# EAGLE schematic cft (EAGLE 5.11), part 5 of 7
## Sheet 34 of 49
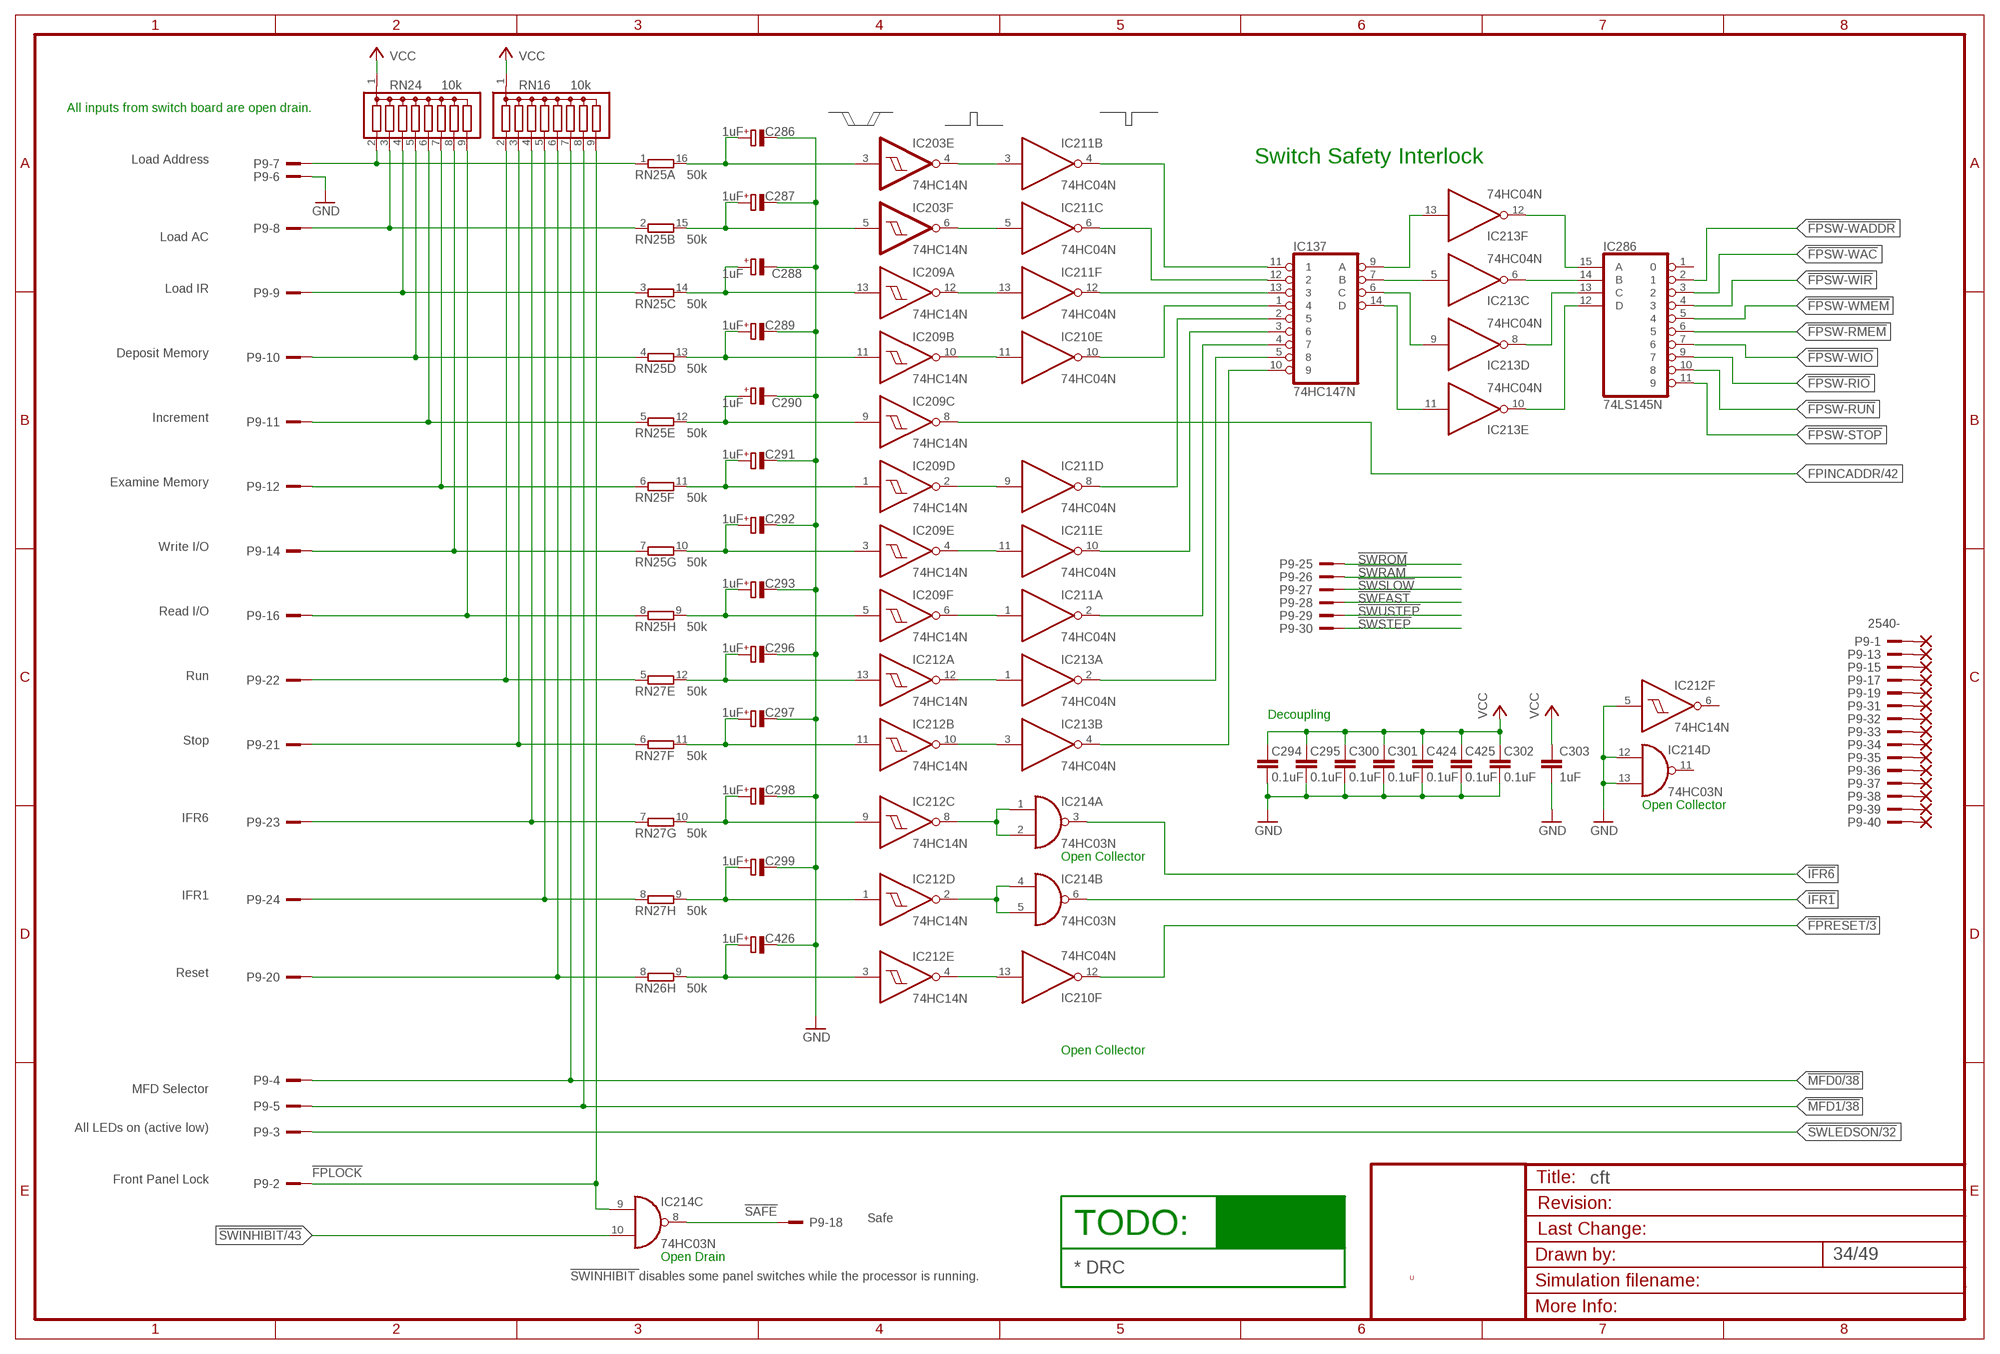
[diagram p33: schematic, sheet 34]

### Parts
C286  1uF  CPOL-EUE1.8-4  [E1,8-4]
C287  1uF  CPOL-EUE1.8-4  [E1,8-4]
C288  1uF  CPOL-EUE1.8-4  [E1,8-4]
C289  1uF  CPOL-EUE1.8-4  [E1,8-4]
C290  1uF  CPOL-EUE1.8-4  [E1,8-4]
C291  1uF  CPOL-EUE1.8-4  [E1,8-4]
C292  1uF  CPOL-EUE1.8-4  [E1,8-4]
C293  1uF  CPOL-EUE1.8-4  [E1,8-4]
C294  0.1uF  C-EU025-024X044  [C025-024X044]
C295  0.1uF  C-EU025-024X044  [C025-024X044]
C296  1uF  CPOL-EUE1.8-4  [E1,8-4]
C297  1uF  CPOL-EUE1.8-4  [E1,8-4]
C298  1uF  CPOL-EUE1.8-4  [E1,8-4]
C299  1uF  CPOL-EUE1.8-4  [E1,8-4]
C300  0.1uF  C-EU025-024X044  [C025-024X044]
C301  0.1uF  C-EU025-024X044  [C025-024X044]
C302  0.1uF  C-EU025-024X044  [C025-024X044]
C303  1uF  C-EU025-024X044  [C025-024X044]
C424  0.1uF  C-EU025-024X044  [C025-024X044]
C425  0.1uF  C-EU025-024X044  [C025-024X044]
C426  1uF  CPOL-EUE1.8-4  [E1,8-4]
IC137  74HC147N  [DIL16]
IC203  74HC14N  [DIL14]
IC209  74HC14N  [DIL14]
IC210  74HC04N  [DIL14]
IC211  74HC04N  [DIL14]
IC212  74HC14N  [DIL14]
IC213  74HC04N  [DIL14]
IC214  74HC03N  [DIL14]
IC286  74LS145N  [DIL16]
P9  2540-  [PAK100/2500-40]
PAD58  1,6/0,8  [1,6/0,8]
PAD61  1,6/0,8  [1,6/0,8]
PAD62  1,6/0,8  [1,6/0,8]
PAD63  1,6/0,8  [1,6/0,8]
PAD64  1,6/0,8  [1,6/0,8]
PAD71  1,6/0,8  [1,6/0,8]
PAD72  1,6/0,8  [1,6/0,8]
PAD73  1,6/0,8  [1,6/0,8]
PAD74  1,6/0,8  [1,6/0,8]
PAD75  1,6/0,8  [1,6/0,8]
PAD76  1,6/0,8  [1,6/0,8]
PAD77  1,6/0,8  [1,6/0,8]
PAD78  1,6/0,8  [1,6/0,8]
PAD79  1,6/0,8  [1,6/0,8]
PAD80  1,6/0,8  [1,6/0,8]
RN16  10k  G08R  [SIL9]
RN24  10k  G08R  [SIL9]
RN25  50k  8R-N  [DIL16]
RN26  50k  8R-N  [DIL16]
RN27  50k  8R-N  [DIL16]

### Nets
!FPLOCK: IC214.9(C:I0) P9.2 RN16.9 ; also sheet 33,35
!FPRESET: IC210.12(F:O) ; also sheet 3,6,40
!FPRIO: IC137.4 IC211.2(A:O) ; also sheet 40,42
!FPRMEM: IC137.2 IC211.8(D:O) ; also sheet 40,42
!FPRUN: IC137.5 IC213.2(A:O) ; also sheet 40,42,43
!FPSTOP: IC137.10 IC213.4(B:O) ; also sheet 40,43
!FPSW-RIO: IC286.9
!FPSW-RMEM: IC286.6
!FPSW-RUN: IC286.10
!FPSW-STOP: IC286.11
!FPSW-WAC: IC286.3
!FPSW-WADDR: IC286.2
!FPSW-WIO: IC286.7
!FPSW-WIR: IC286.4
!FPSW-WMEM: IC286.5
!FPWAC: IC137.12 IC211.6(C:O) ; also sheet 40,41,42
!FPWADDR: IC137.11 IC211.4(B:O) ; also sheet 40,41,42
!FPWIO: IC137.3 IC211.10(E:O) ; also sheet 40,41,42
!FPWIR: IC137.13 IC211.12(F:O) ; also sheet 40,41,42
!FPWMEM: IC137.1 IC210.10(E:O) ; also sheet 40,41,42
!IFR1: IC214.6(B:O) ; also sheet 39,40
!IFR6: IC214.3(A:O) ; also sheet 39,40
!MFD0: P9.4 RN16.7 ; also sheet 38
!MFD1: P9.5 RN16.8 ; also sheet 38
!SAFE: IC214.8(C:O) P9.18 ; also sheet 33,35
!SWFAST: P9.28 ; also sheet 33
!SWINHIBIT: IC214.10(C:I1) ; also sheet 40,43
!SWLEDSON: P9.3 ; also sheet 32,33
!SWRAM: P9.26 ; also sheet 33
!SWROM: P9.25 ; also sheet 33
!SWSLOW: P9.27 ; also sheet 33
!SWSTEP: P9.30 ; also sheet 33
!SWUSTEP: P9.29 ; also sheet 33
FPINCADDR: IC209.8(C:O) ; also sheet 40,42
GND [low power]: C286.- C287.- C288.- C289.- C290.- C291.- C292.- C293.- C294.1 C295.1 C296.- C297.- C298.- C299.- C300.1 C301.1 C302.1 C303.2 C424.1 C425.1 C426.- IC212.5(F:I) IC214.12(D:I0) IC214.13(D:I1) P9.6 ; also sheet 2,3,4,5,6,7,8,9,10,11,12,13,14,15,16,17,18,19,20,21,22,24,25,26,27,28,29,30,31,32,33,35,36,37,38,39,40,41,42,43,44,45,46,47,48,49
N$16: IC137.7(B) IC213.5(C:I)
N$116: IC137.6(C) IC213.9(D:I)
N$117: IC137.9(A) IC213.13(F:I)
N$118: IC137.14(D) IC213.11(E:I)
N$119: IC213.6(C:O) IC286.14(B)
N$291: C287.+ IC203.5(F:I) RN25.15
N$292: C288.+ IC209.13(A:I) RN25.14
N$294: C286.+ IC203.3(E:I) RN25.16
N$295: IC203.4(E:O) IC211.3(B:I)
N$296: IC203.6(F:O) IC211.5(C:I)
N$297: IC209.12(A:O) IC211.13(F:I)
N$298: IC209.10(B:O) IC210.11(E:I)
N$300: C291.+ IC209.1(D:I) RN25.11
N$301: IC209.2(D:O) IC211.9(D:I)
N$302: C292.+ IC209.3(E:I) RN25.10
N$303: IC209.4(E:O) IC211.11(E:I)
N$304: C293.+ IC209.5(F:I) RN25.9
N$305: IC209.6(F:O) IC211.1(A:I)
N$306: C289.+ IC209.11(B:I) RN25.13
N$307: P9.7 RN24.2 RN25.1
N$308: P9.8 RN24.3 RN25.2
N$309: P9.9 RN24.4 RN25.3
N$310: P9.10 RN24.5 RN25.4
N$311: P9.11 RN24.6 RN25.5
N$312: P9.12 RN24.7 RN25.6
N$313: P9.14 RN24.8 RN25.7
N$314: P9.16 RN24.9 RN25.8
N$315: C296.+ IC212.13(A:I) RN27.12
N$316: C297.+ IC212.11(B:I) RN27.11
N$317: P9.22 RN16.2 RN27.5
N$318: P9.21 RN16.3 RN27.6
N$319: IC212.12(A:O) IC213.1(A:I)
N$320: IC212.10(B:O) IC213.3(B:I)
N$321: C298.+ IC212.9(C:I) RN27.10
N$322: C299.+ IC212.1(D:I) RN27.9
N$332: P9.23 RN16.4 RN27.7
N$333: P9.24 RN16.5 RN27.8
N$334: IC212.8(C:O) IC214.1(A:I0) IC214.2(A:I1)
N$335: IC212.2(D:O) IC214.4(B:I0) IC214.5(B:I1)
N$336: C290.+ IC209.9(C:I) RN25.12
N$575: IC213.12(F:O) IC286.15(A)
N$576: IC213.8(D:O) IC286.13(C)
N$904: IC213.10(E:O) IC286.12(D)
N$916: P9.40 PAD80.1(P)
N$917: P9.1 PAD58.1(P)
N$921: P9.13 PAD61.1(P)
N$922: P9.15 PAD62.1(P)
N$923: P9.17 PAD63.1(P)
N$924: P9.19 PAD64.1(P)
N$931: P9.31 PAD71.1(P)
N$932: P9.32 PAD72.1(P)
N$933: P9.33 PAD73.1(P)
N$934: P9.34 PAD74.1(P)
N$935: P9.35 PAD75.1(P)
N$936: P9.36 PAD76.1(P)
N$937: P9.37 PAD77.1(P)
N$938: P9.38 PAD78.1(P)
N$939: P9.39 PAD79.1(P)
N$940: C426.+ IC212.3(E:I) RN26.9
N$941: P9.20 RN16.6 RN26.8
N$942: IC210.13(F:I) IC212.4(E:O)
VCC [low power]: C294.2 C295.2 C300.2 C301.2 C302.2 C303.1 C424.2 C425.2 RN16.1 RN24.1 ; also sheet 2,3,4,6,7,8,9,10,11,12,13,14,15,16,17,18,19,20,21,22,24,25,26,27,28,29,30,31,35,36,37,38,39,40,41,42,43,44,45,46,47,48,49
Unconnected: IC210.1(A:I) IC210.2(A:O) IC210.3(B:I) IC210.4(B:O) IC210.5(C:I) IC210.6(C:O) IC210.8(D:O) IC210.9(D:I) IC212.6(F:O) IC214.11(D:O) IC286.1 RN26.1 RN26.2 RN26.3 RN26.4 RN26.5 RN26.6 RN26.7 RN26.10 RN26.11 RN26.12 RN26.13 RN26.14 RN26.15 RN26.16 RN27.1 RN27.2 RN27.3 RN27.4 RN27.13 RN27.14 RN27.15 RN27.16

### Notes on the sheet
- All inputs from switch board are open drain.
- Load Address | Switch Safety Interlock
- Load AC
- Load IR
- Deposit Memory
- Increment
- Examine Memory
- Write I/O
- Read I/O
- Run
- Decoupling
- Stop
- Open Collector
- IFR6
- Open Collector
- IFR1
- Reset
- Open Collector
- MFD Selector
- All LEDs on (active low)
- Front Panel Lock
- Safe
- TODO:
- Open Drain
- * DRC
- !SWINHIBIT !disables some panel switches while the processor is running. | U

## Sheet 35 of 49
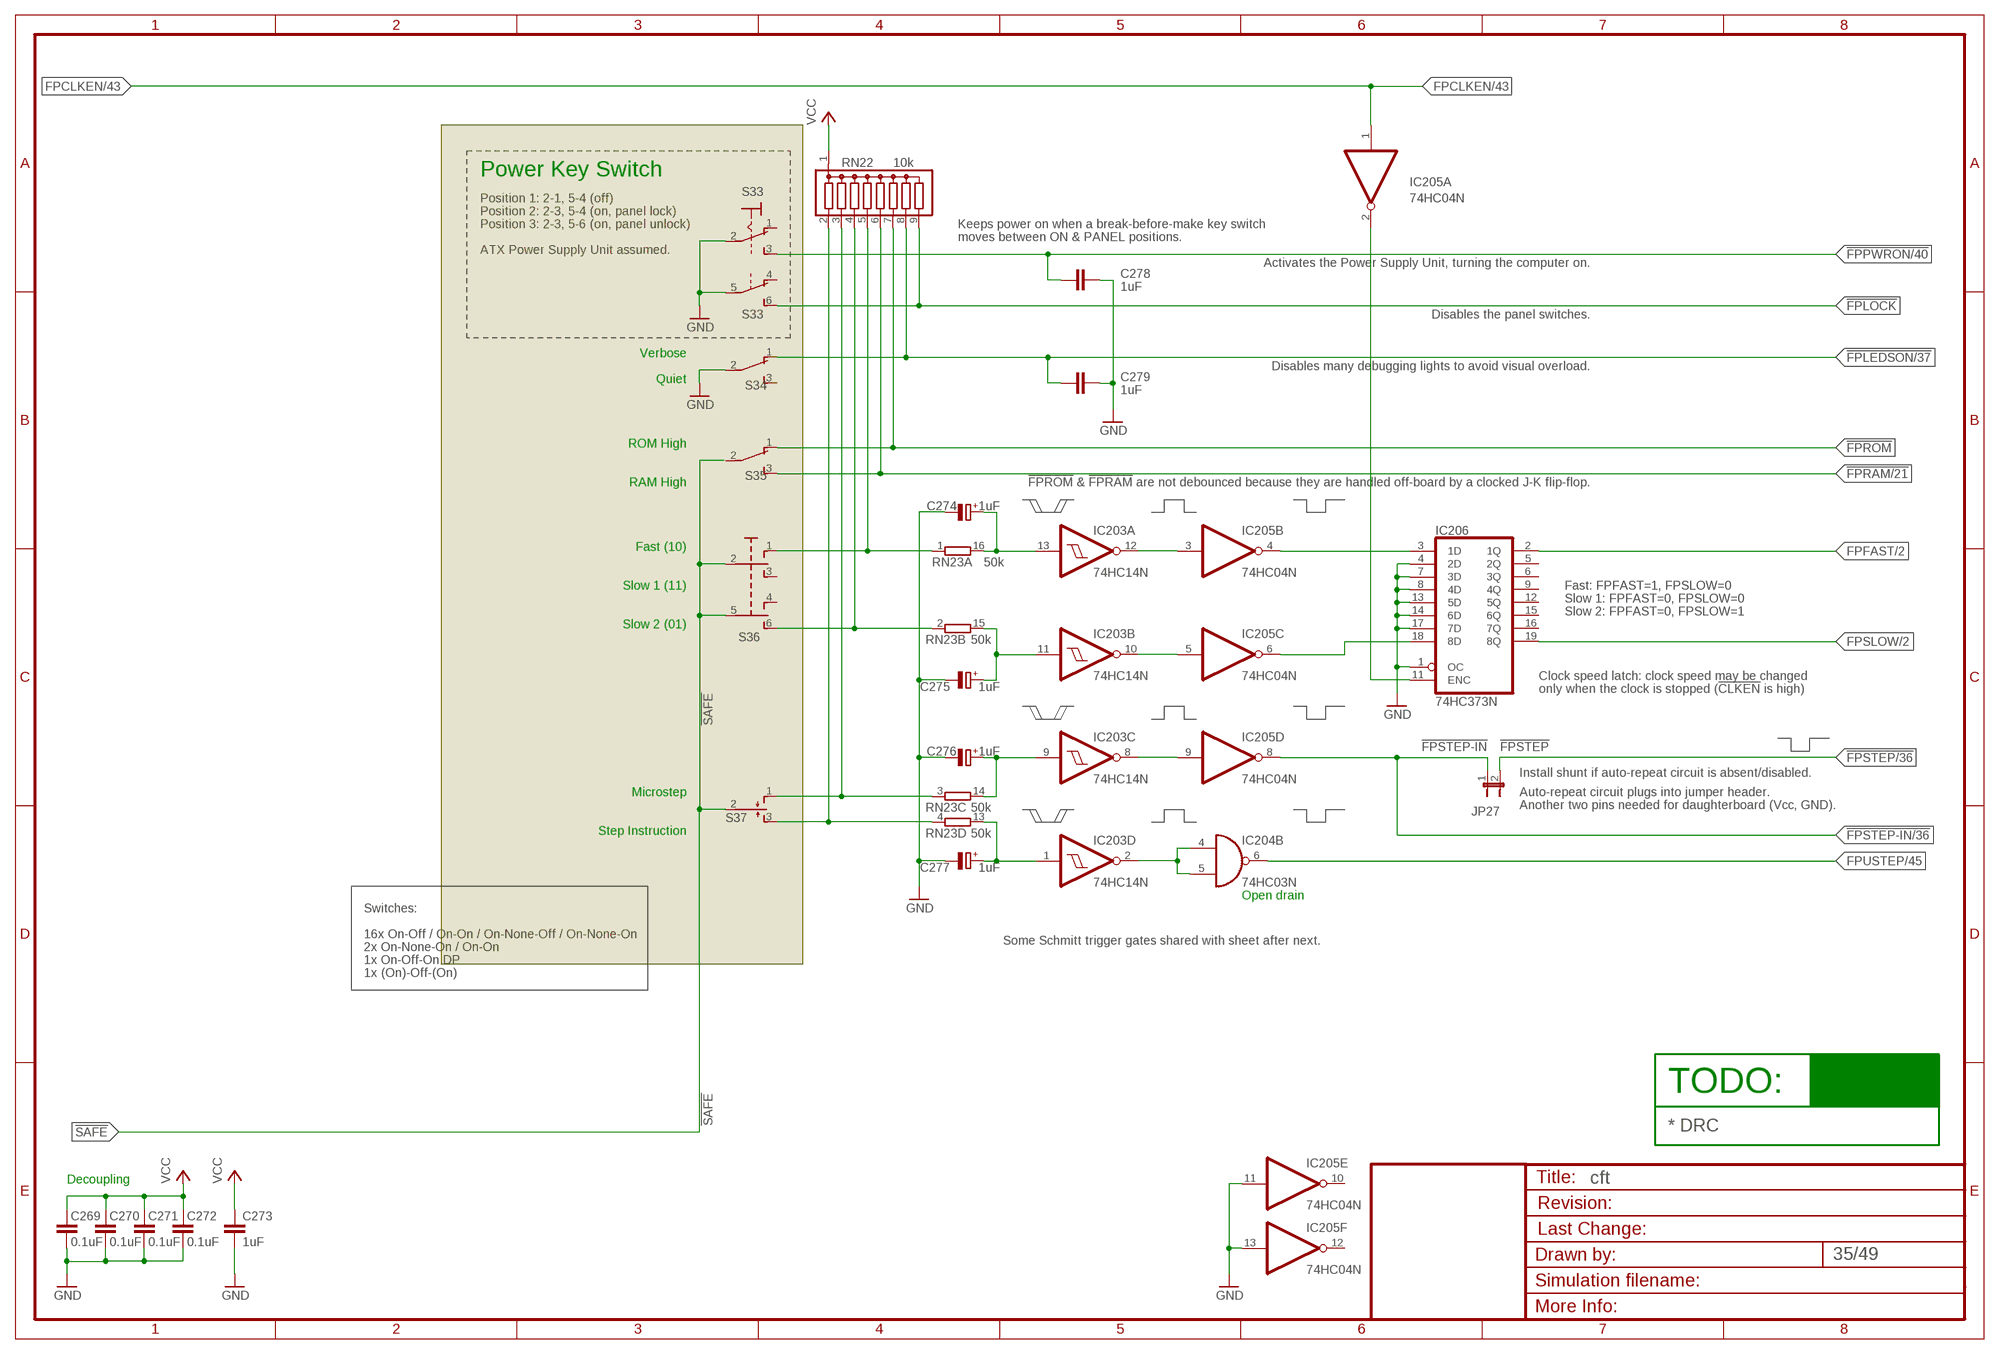
[diagram p34: schematic, sheet 35]

### Parts
C269  0.1uF  C-EU025-024X044  [C025-024X044]
C270  0.1uF  C-EU025-024X044  [C025-024X044]
C271  0.1uF  C-EU025-024X044  [C025-024X044]
C272  0.1uF  C-EU025-024X044  [C025-024X044]
C273  1uF  C-EU025-024X044  [C025-024X044]
C274  1uF  CPOL-EUE1.8-4  [E1,8-4]
C275  1uF  CPOL-EUE1.8-4  [E1,8-4]
C276  1uF  CPOL-EUE1.8-4  [E1,8-4]
C277  1uF  CPOL-EUE1.8-4  [E1,8-4]
C278  1uF  C-EU025-024X044  [C025-024X044]
C279  1uF  C-EU025-024X044  [C025-024X044]
IC204  74HC03N  [DIL14]
IC205  74HC04N  [DIL14]
IC206  74HC373N  [DIL20]
JP27  JP1E  [JP1]
RN22  10k  G08R  [SIL9]
RN23  50k  8R-N  [DIL16]
S33  320-938  [320-938]
S34  TL36PO  [TL3XPO]
S35  TL36PO  [TL3XPO]
S36  TL49PO  [TL4XPO]
S37  TL37PO  [TL3XPO]

### Nets
!FPLEDSON: C279.1 RN22.8 S34.1(O) ; also sheet 37,39
!FPLOCK: RN22.9 S33.6(B:S) ; also sheet 33,34
!FPPWRON: C278.1 S33.3(1:S) ; also sheet 40
!FPRAM: RN22.6 S35.3(S) ; also sheet 21,40
!FPROM: RN22.7 S35.1(O) ; also sheet 40
!FPSTEP: JP27.2 ; also sheet 36,40,43
!FPSTEP-IN: IC205.8(D:O) JP27.1 ; also sheet 36
!SAFE: S36.2(P) S36.5(P1) S37.2(P) ; also sheet 33,34
FPCLKEN: IC205.1(A:I) ; also sheet 2,6,43,45
FPFAST: IC206.2(1Q) ; also sheet 2,6,40
FPSLOW: IC206.19(8Q) ; also sheet 2,6,40
FPUSTEP: IC204.6(B:O) ; also sheet 2,6,40,45
GND [low power]: C269.1 C270.1 C271.1 C272.1 C273.2 C274.- C275.- C276.- C277.- C278.2 C279.2 IC205.11(E:I) IC205.13(F:I) IC206.1(OC) IC206.4(2D) IC206.7(3D) IC206.8(4D) IC206.13(5D) IC206.14(6D) IC206.17(7D) S33.2(1:P) S33.5(B:P) ; also sheet 2,3,4,5,6,7,8,9,10,11,12,13,14,15,16,17,18,19,20,21,22,24,25,26,27,28,29,30,31,32,33,34,36,37,38,39,40,41,42,43,44,45,46,47,48,49
N$277: C276.+ IC203.9(C:I) RN23.14
N$278: C277.+ IC203.1(D:I) RN23.13
N$279: RN22.3 RN23.3 S37.1(O)
N$281: RN22.2 RN23.4 S37.3(S)
N$282: C274.+ IC203.13(A:I) RN23.16
N$283: C275.+ IC203.11(B:I) RN23.15
N$284: IC203.2(D:O) IC204.4(B:I0) IC204.5(B:I1)
N$285: RN22.5 RN23.1 S36.1(O)
N$286: RN22.4 RN23.2 S36.6(S1)
N$287: IC203.12(A:O) IC205.3(B:I)
N$288: IC203.10(B:O) IC205.5(C:I)
N$290: IC203.8(C:O) IC205.9(D:I)
N$685 [low power]: S34.2(P)
N$688: IC205.4(B:O) IC206.3(1D)
N$689: IC205.6(C:O) IC206.18(8D)
N$691: IC205.2(A:O) IC206.11(ENC)
VCC [low power]: C269.2 C270.2 C271.2 C272.2 C273.1 RN22.1 ; also sheet 2,3,4,6,7,8,9,10,11,12,13,14,15,16,17,18,19,20,21,22,24,25,26,27,28,29,30,31,34,36,37,38,39,40,41,42,43,44,45,46,47,48,49
Unconnected: IC205.10(E:O) IC205.12(F:O) IC206.5(2Q) IC206.6(3Q) IC206.9(4Q) IC206.12(5Q) IC206.15(6Q) IC206.16(7Q) RN23.5 RN23.6 RN23.7 RN23.8 RN23.9 RN23.10 RN23.11 RN23.12 S33.1(1:O) S33.4(B:O) S34.3(S) S35.2(P) S36.3(S) S36.4(O1)

### Notes on the sheet
- Power Key Switch
- Position 1: 2-1, 5-4 (off)
- Position 2: 2-3, 5-4 (on, panel lock)
- Position 3: 2-3, 5-6 (on, panel unlock) | Keeps power on when a break-before-make key switch
- moves between ON & PANEL positions.
- ATX Power Supply Unit assumed.
- Activates the Power Supply Unit, turning the computer on.
- Disables the panel switches.
- Verbose
- Disables many debugging lights to avoid visual overload.
- Quiet
- ROM High
- RAM High | !FPROM! & !FPRAM! are not debounced because they are handled off-board by a clocked J-K flip-flop.
- Fast (10)
- Slow 1 (11) | Fast: FPFAST=1, FPSLOW=0
- Slow 1: FPFAST=0, FPSLOW=0
- Slow 2: FPFAST=0, FPSLOW=1
- Slow 2 (01)
- Clock speed latch: clock speed may be changed
- only when the clock is stopped (!CLKEN! is high)
- Install shunt if auto-repeat circuit is absent/disabled.
- Microstep | Auto-repeat circuit plugs into jumper header.
- Another two pins needed for daughterboard (Vcc, GND).
- Step Instruction
- Open drain
- Switches:
- 16x On-Off / On-On / On-None-Off / On-None-On
- Some Schmitt trigger gates shared with sheet after next.
- 2x On-None-On / On-On
- 1x On-Off-On DP
- 1x (On)-Off-(On)
- TODO:
- * DRC
- Decoupling

## Sheet 36 of 49
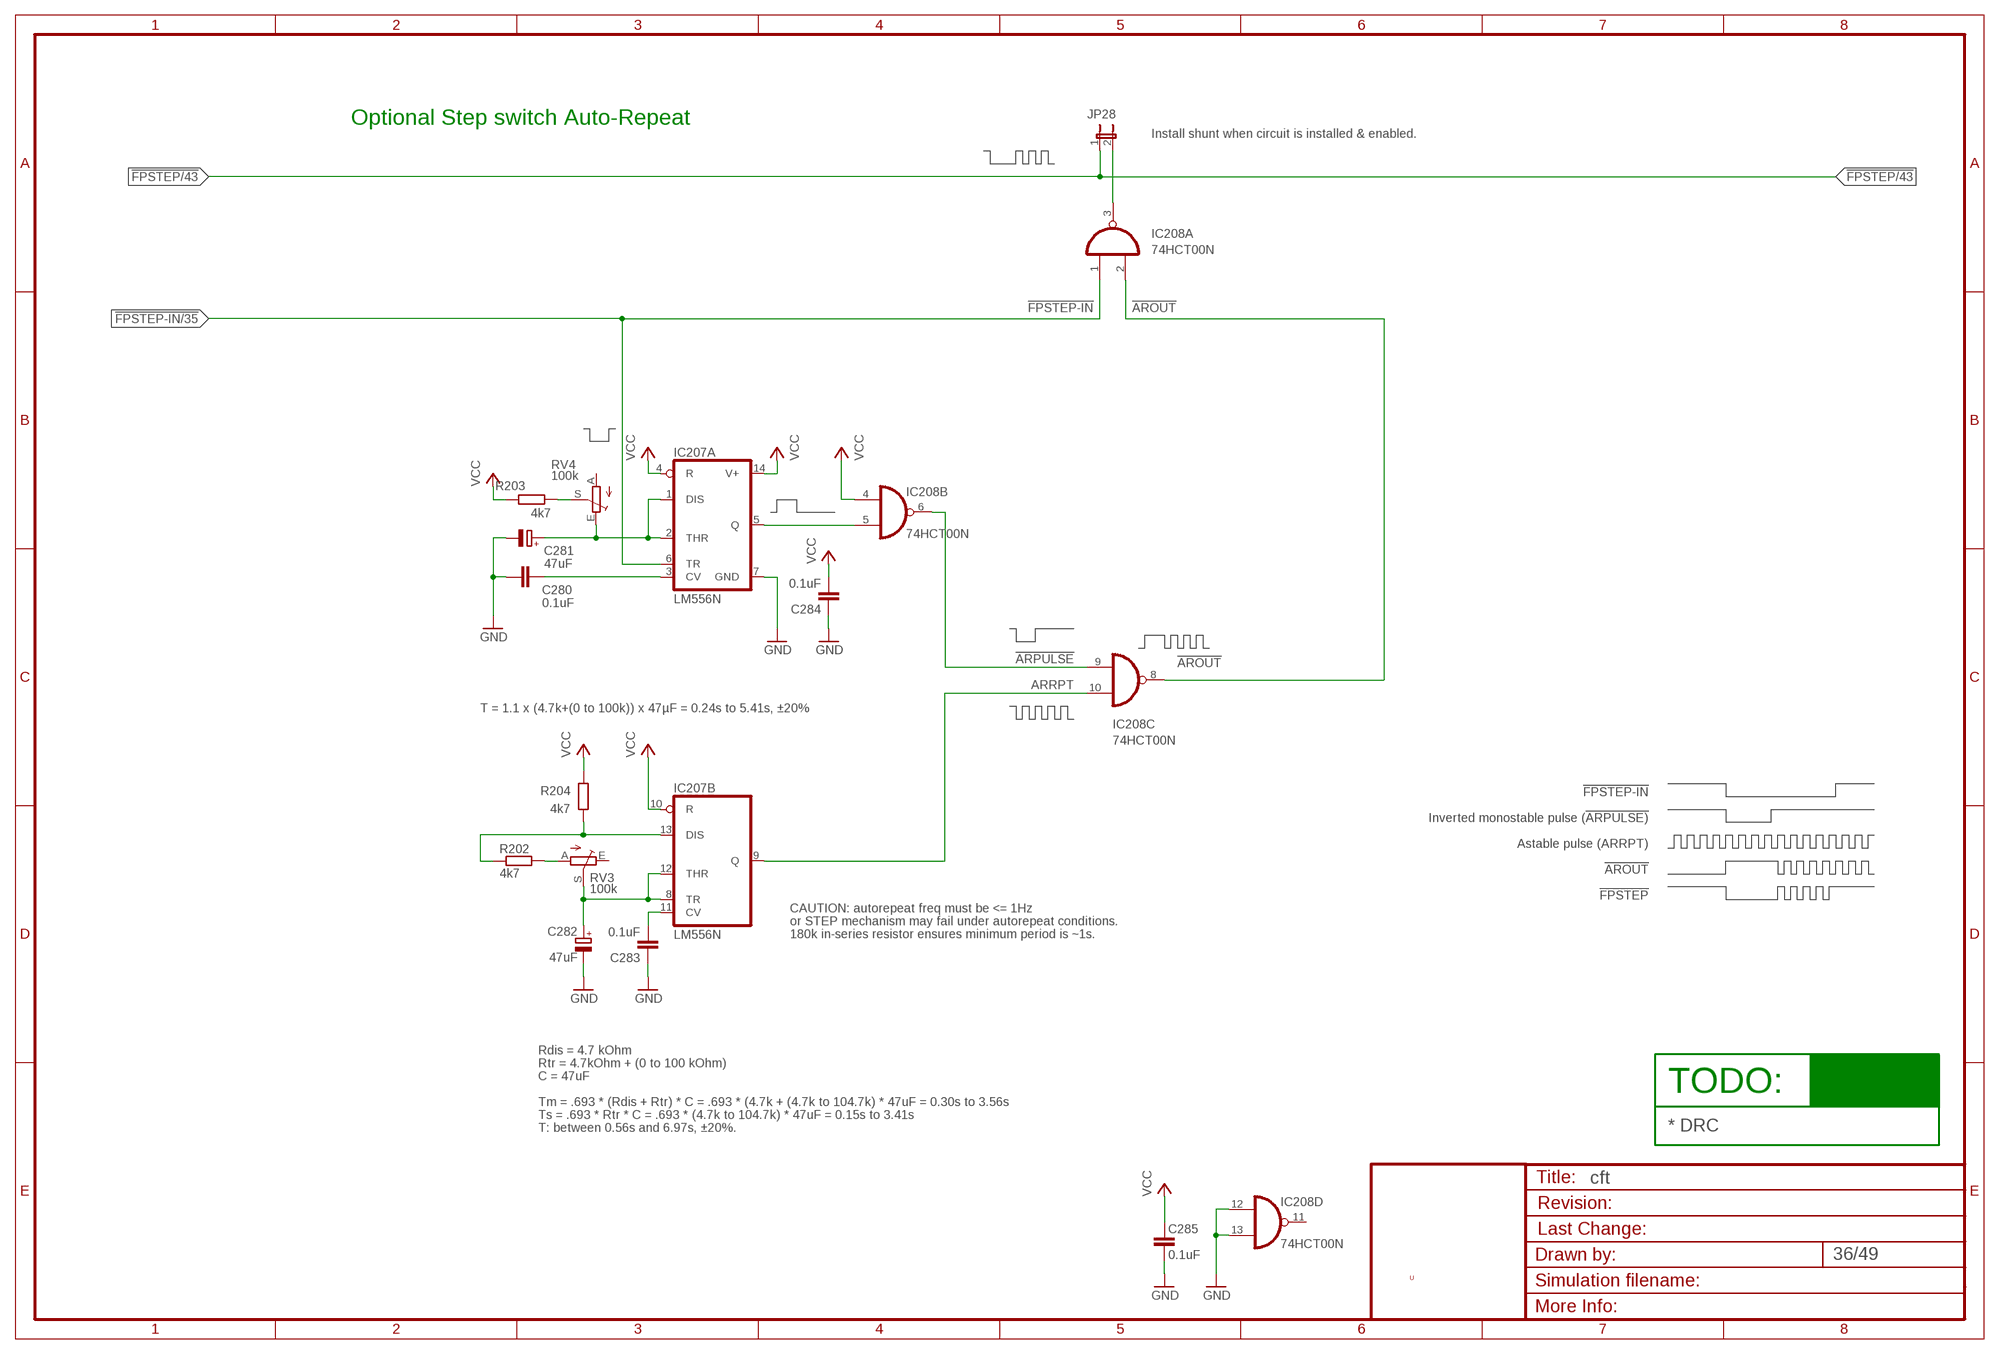
[diagram p35: schematic, sheet 36]

### Parts
C280  0.1uF  C-EU025-024X044  [C025-024X044]
C281  47uF  CPOL-EUE2.5-5  [E2,5-5]
C282  47uF  CPOL-EUE2.5-5  [E2,5-5]
C283  0.1uF  C-EU025-024X044  [C025-024X044]
C284  0.1uF  C-EU025-024X044  [C025-024X044]
C285  0.1uF  C-EU025-024X044  [C025-024X044]
IC207  LM556N  [DIL14]
IC208  74HCT00N  [DIL14]
JP28  JP1E  [JP1]
R202  4k7  R-EU_0204/7  [0204/7]
R203  4k7  R-EU_0204/7  [0204/7]
R204  4k7  R-EU_0204/7  [0204/7]
RV3  100k  TRIM_EU-CT6  [CT6]
RV4  100k  TRIM_EU-CT6  [CT6]

### Nets
!AROUT: IC208.2(A:I1) IC208.8(C:O)
!ARPULSE: IC208.6(B:O) IC208.9(C:I0)
!FPSTEP: JP28.1 ; also sheet 35,40,43
!FPSTEP-IN: IC207.6(A:TR) IC208.1(A:I0) ; also sheet 35
ARRPT: IC207.9(B:Q) IC208.10(C:I1)
GND [low power]: C280.1 C281.- C282.- C283.1 C284.1 C285.1 IC207.7(A:GND) IC208.12(D:I0) IC208.13(D:I1) ; also sheet 2,3,4,5,6,7,8,9,10,11,12,13,14,15,16,17,18,19,20,21,22,24,25,26,27,28,29,30,31,32,33,34,35,37,38,39,40,41,42,43,44,45,46,47,48,49
N$293: IC208.3(A:O) JP28.2
N$502: C283.2 IC207.11(B:CV)
N$503: C282.+ IC207.8(B:TR) IC207.12(B:THR) RV3.S
N$504: R202.2 RV3.A
N$518: IC207.13(B:DIS) R202.1 R204.1
N$519: C281.+ IC207.1(A:DIS) IC207.2(A:THR) RV4.E
N$520: C280.2 IC207.3(A:CV)
N$547: R203.1 RV4.S
N$548: IC207.5(A:Q) IC208.5(B:I1)
VCC [low power]: C284.2 C285.2 IC207.4(A:R) IC207.10(B:R) IC207.14(A:V+) IC208.4(B:I0) R203.2 R204.2 ; also sheet 2,3,4,6,7,8,9,10,11,12,13,14,15,16,17,18,19,20,21,22,24,25,26,27,28,29,30,31,34,35,37,38,39,40,41,42,43,44,45,46,47,48,49
Unconnected: IC208.11(D:O) RV3.E RV4.A

### Notes on the sheet
- Optional Step switch Auto-Repeat
- Install shunt when circuit is installed & enabled.
- T = 1.1 x (4.7k+(0 to 100k)) x 47µF = 0.24s to 5.41s, ±20%
- !FPSTEP-IN
- Inverted monostable pulse (!ARPULSE)
- Astable pulse (ARRPT)
- !AROUT
- !FPSTEP
- CAUTION: autorepeat freq must be <= 1Hz
- or STEP mechanism may fail under autorepeat conditions.
- 180k in-series resistor ensures minimum period is ~1s.
- Rdis = 4.7 kOhm
- Rtr = 4.7kOhm + (0 to 100 kOhm)
- C = 47uF
- TODO:
- Tm = .693 * (Rdis + Rtr) * C = .693 * (4.7k + (4.7k to 104.7k) * 47uF = 0.30s to 3.56s
- Ts = .693 * Rtr * C = .693 * (4.7k to 104.7k) * 47uF = 0.15s to 3.41s
- T: between 0.56s and 6.97s, ±20%. | * DRC
- U

## Sheet 37 of 49
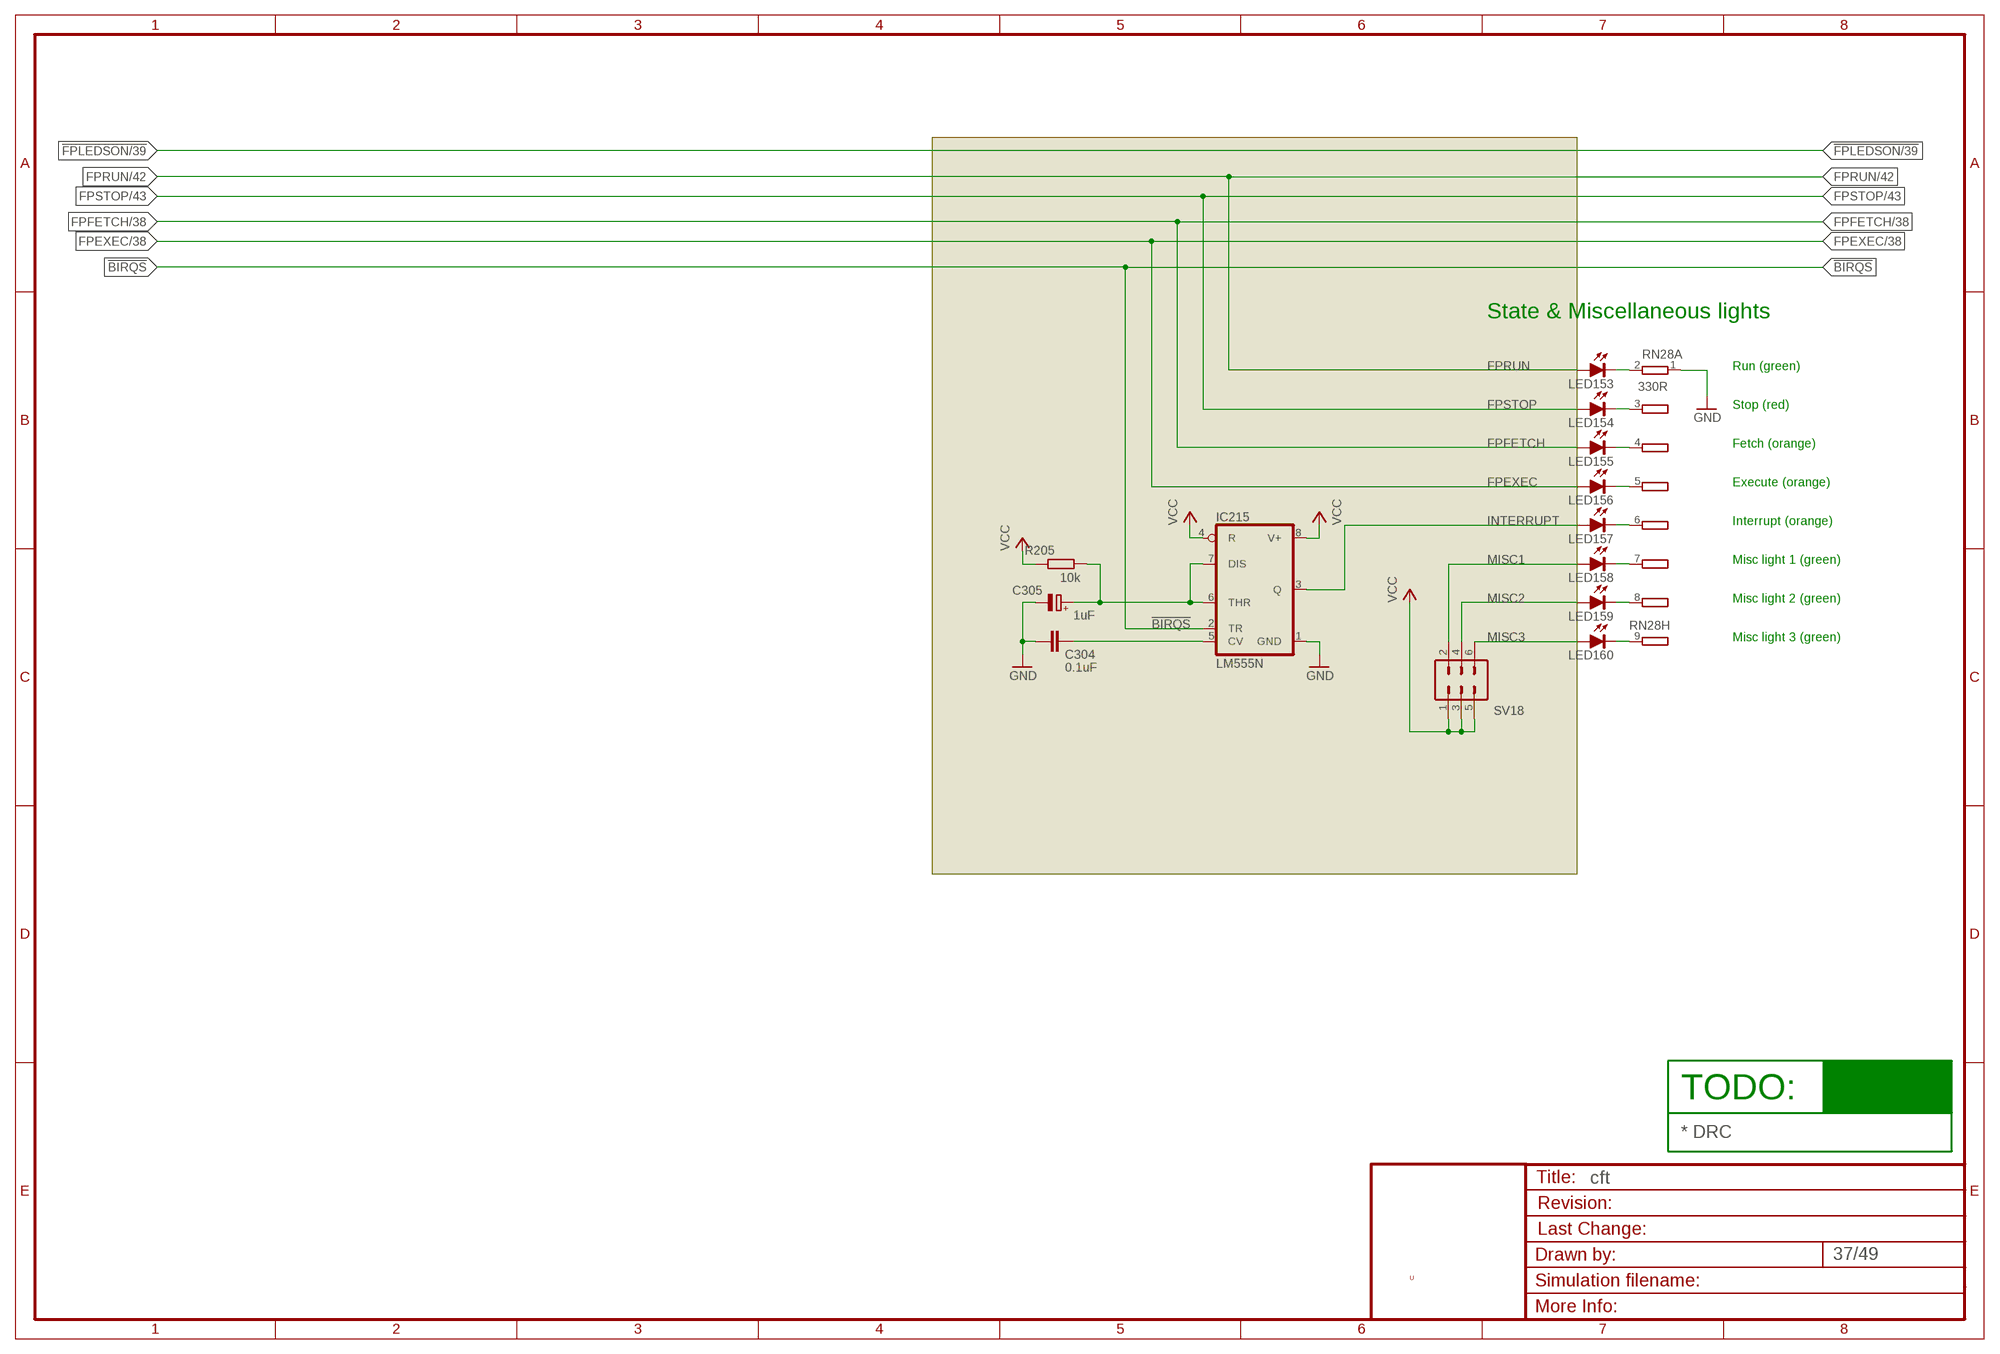
[diagram p36: schematic, sheet 37]

### Parts
C304  0.1uF  C-EU025-024X044  [C025-024X044]
C305  1uF  CPOL-EUE2.5-5  [E2,5-5]
IC215  LM555N  [DIL08]
LED153  LED-5MM-GREEN  [LED5MM]
LED154  LED-5MM-RED  [LED5MM]
LED155  LED-5MM-AMBER  [LED5MM]
LED156  LED-5MM-AMBER  [LED5MM]
LED157  LED-5MM-AMBER  [LED5MM]
LED158  LED-5MM-GREEN  [LED5MM]
LED159  LED-5MM-GREEN  [LED5MM]
LED160  LED-5MM-GREEN  [LED5MM]
R205  10k  R-EU_0204/7  [0204/7]
RN28  330R  GE08R  [SIL9]
SV18  3-pin-header  MA03-2  [MA03-2]

### Nets
!BIRQS: IC215.2(TR) ; also sheet 6,38,40
FPEXEC: LED156.A ; also sheet 32,38
FPFETCH: LED155.A ; also sheet 32,38,40,43
FPRUN: LED153.A ; also sheet 32,40,42,43
FPSTOP: LED154.A ; also sheet 32,40,43
GND [low power]: C304.1 C305.- IC215.1(GND) RN28.1 ; also sheet 2,3,4,5,6,7,8,9,10,11,12,13,14,15,16,17,18,19,20,21,22,24,25,26,27,28,29,30,31,32,33,34,35,36,38,39,40,41,42,43,44,45,46,47,48,49
INTERRUPT: IC215.3(Q) LED157.A
MISC1: LED158.A SV18.2 ; also sheet 32
MISC2: LED159.A SV18.4 ; also sheet 32
MISC3: LED160.A SV18.6 ; also sheet 32
N$39: C305.+ IC215.6(THR) IC215.7(DIS) R205.1
N$402: C304.2 IC215.5(CV)
N$510: LED153.K(C) RN28.2
N$511: LED154.K(C) RN28.3
N$512: LED155.K(C) RN28.4
N$513: LED156.K(C) RN28.5
N$514: LED157.K(C) RN28.6
N$515: LED158.K(C) RN28.7
N$516: LED159.K(C) RN28.8
N$517: LED160.K(C) RN28.9
VCC [low power]: IC215.4(R) IC215.8(V+) R205.2 SV18.1 SV18.3 SV18.5 ; also sheet 2,3,4,6,7,8,9,10,11,12,13,14,15,16,17,18,19,20,21,22,24,25,26,27,28,29,30,31,34,35,36,38,39,40,41,42,43,44,45,46,47,48,49

### Notes on the sheet
- State & Miscellaneous lights
- Run (green)
- Stop (red)
- Fetch (orange)
- Execute (orange)
- Interrupt (orange)
- Misc light 1 (green)
- Misc light 2 (green)
- Misc light 3 (green)
- TODO:
- * DRC
- U

## Sheet 38 of 49
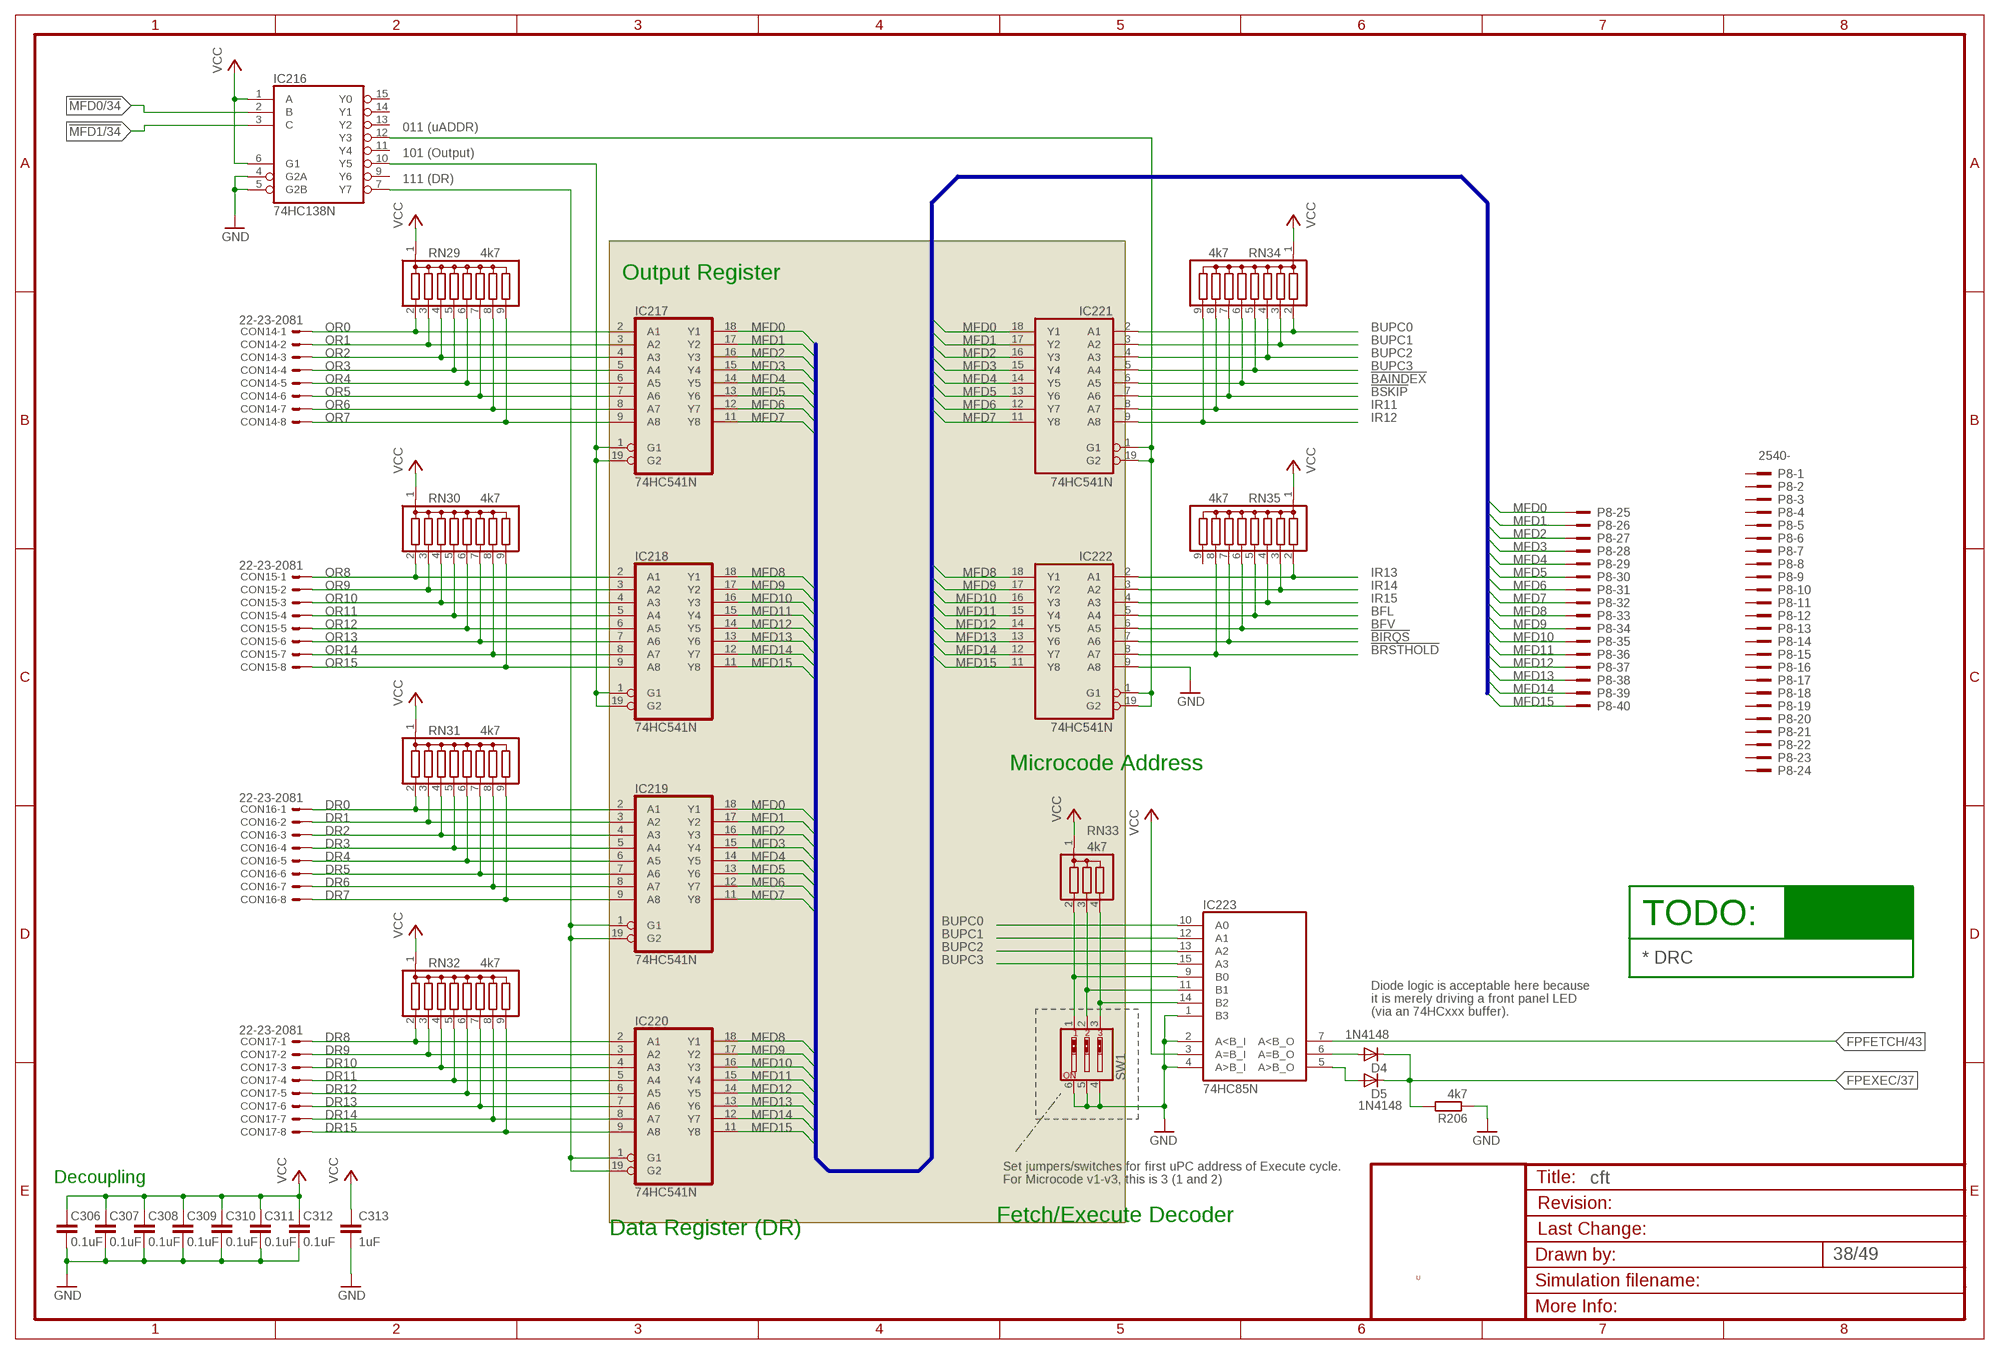
[diagram p37: schematic, sheet 38]

### Parts
C306  0.1uF  C-EU025-024X044  [C025-024X044]
C307  0.1uF  C-EU025-024X044  [C025-024X044]
C308  0.1uF  C-EU025-024X044  [C025-024X044]
C309  0.1uF  C-EU025-024X044  [C025-024X044]
C310  0.1uF  C-EU025-024X044  [C025-024X044]
C311  0.1uF  C-EU025-024X044  [C025-024X044]
C312  0.1uF  C-EU025-024X044  [C025-024X044]
C313  1uF  C-EU025-024X044  [C025-024X044]
CON14  22-23-2081  [22-23-2081]
CON15  22-23-2081  [22-23-2081]
CON16  22-23-2081  [22-23-2081]
CON17  22-23-2081  [22-23-2081]
D4  1N4148  1N4148DO35-7  [DO35-7]
D5  1N4148  1N4148DO35-7  [DO35-7]
IC216  74HC138N  [DIL16]
IC217  74HC541N  [DIL20]
IC218  74HC541N  [DIL20]
IC219  74HC541N  [DIL20]
IC220  74HC541N  [DIL20]
IC221  74HC541N  [DIL20]
IC222  74HC541N  [DIL20]
IC223  74HC85N  [DIL16]
P8  2540-  [PAK100/2500-40]
R206  4k7  R-EU_0204/7  [0204/7]
RN29  4k7  G08R  [SIL9]
RN30  4k7  G08R  [SIL9]
RN31  4k7  G08R  [SIL9]
RN32  4k7  G08R  [SIL9]
RN33  4k7  G03R  [SIL4]
RN34  4k7  G08R  [SIL9]
RN35  4k7  G08R  [SIL9]
SW1  SW_DIP-3  [EDG-03]

### Nets
!BAINDEX: IC221.6(A5) RN34.6 ; also sheet 6,40
!BIRQS: IC222.7(A6) RN35.7 ; also sheet 6,37,40
!BRSTHOLD: IC222.8(A7) RN35.8 ; also sheet 6,40
!BSKIP: IC221.7(A6) RN34.7 ; also sheet 6,40
!MFD0: IC216.2(B) ; also sheet 34
!MFD1: IC216.3(C) ; also sheet 34
BFL: IC222.5(A4) RN35.5 ; also sheet 6,32,40
BFV: IC222.6(A5) RN35.6 ; also sheet 6,32,40
BUPC0: IC221.2(A1) IC223.10(A0) RN34.2 ; also sheet 6,40
BUPC1: IC221.3(A2) IC223.12(A1) RN34.3 ; also sheet 6,40
BUPC2: IC221.4(A3) IC223.13(A2) RN34.4 ; also sheet 6,40
BUPC3: IC221.5(A4) IC223.15(A3) RN34.5 ; also sheet 6,40
DR0: CON16.1 IC219.2(A1) RN31.2 ; also sheet 15
DR1: CON16.2 IC219.3(A2) RN31.3 ; also sheet 15
DR2: CON16.3 IC219.4(A3) RN31.4 ; also sheet 15
DR3: CON16.4 IC219.5(A4) RN31.5 ; also sheet 15
DR4: CON16.5 IC219.6(A5) RN31.6 ; also sheet 15
DR5: CON16.6 IC219.7(A6) RN31.7 ; also sheet 15
DR6: CON16.7 IC219.8(A7) RN31.8 ; also sheet 15
DR7: CON16.8 IC219.9(A8) RN31.9 ; also sheet 15
DR8: CON17.1 IC220.2(A1) RN32.2 ; also sheet 15
DR9: CON17.2 IC220.3(A2) RN32.3 ; also sheet 15
DR10: CON17.3 IC220.4(A3) RN32.4 ; also sheet 15
DR11: CON17.4 IC220.5(A4) RN32.5 ; also sheet 15
DR12: CON17.5 IC220.6(A5) RN32.6 ; also sheet 15
DR13: CON17.6 IC220.7(A6) RN32.7 ; also sheet 15
DR14: CON17.7 IC220.8(A7) RN32.8 ; also sheet 15
DR15: CON17.8 IC220.9(A8) RN32.9 ; also sheet 15
FPEXEC: D4.C D5.C R206.2 ; also sheet 32,37
FPFETCH: IC223.7(A<B_O) ; also sheet 32,37,40,43
GND [low power]: C306.1 C307.1 C308.1 C309.1 C310.1 C311.1 C312.1 C313.2 IC216.4(G2A) IC216.5(G2B) IC222.9(A8) IC223.1(B3) IC223.2(A<B_I) IC223.4(A>B_I) R206.1 SW1.4 SW1.5 SW1.6 ; also sheet 2,3,4,5,6,7,8,9,10,11,12,13,14,15,16,17,18,19,20,21,22,24,25,26,27,28,29,30,31,32,33,34,35,36,37,39,40,41,42,43,44,45,46,47,48,49
IR11: IC221.8(A7) RN34.8 ; also sheet 4,6,10,32
IR12: IC221.9(A8) RN34.9 ; also sheet 4,6,10,32
IR13: IC222.2(A1) RN35.2 ; also sheet 4,6,10,32
IR14: IC222.3(A2) RN35.3 ; also sheet 4,6,10,32
IR15: IC222.4(A3) RN35.4 ; also sheet 4,6,10,32
MFD0: IC217.18(Y1) IC219.18(Y1) IC221.18(Y1) P8.25 ; also sheet 32
MFD1: IC217.17(Y2) IC219.17(Y2) IC221.17(Y2) P8.26 ; also sheet 32
MFD2: IC217.16(Y3) IC219.16(Y3) IC221.16(Y3) P8.27 ; also sheet 32
MFD3: IC217.15(Y4) IC219.15(Y4) IC221.15(Y4) P8.28 ; also sheet 32
MFD4: IC217.14(Y5) IC219.14(Y5) IC221.14(Y5) P8.29 ; also sheet 32
MFD5: IC217.13(Y6) IC219.13(Y6) IC221.13(Y6) P8.30 ; also sheet 32
MFD6: IC217.12(Y7) IC219.12(Y7) IC221.12(Y7) P8.31 ; also sheet 32
MFD7: IC217.11(Y8) IC219.11(Y8) IC221.11(Y8) P8.32 ; also sheet 32
MFD8: IC218.18(Y1) IC220.18(Y1) IC222.18(Y1) P8.33 ; also sheet 32
MFD9: IC218.17(Y2) IC220.17(Y2) IC222.17(Y2) P8.34 ; also sheet 32
MFD10: IC218.16(Y3) IC220.16(Y3) IC222.16(Y3) P8.35 ; also sheet 32
MFD11: IC218.15(Y4) IC220.15(Y4) IC222.15(Y4) P8.36 ; also sheet 32
MFD12: IC218.14(Y5) IC220.14(Y5) IC222.14(Y5) P8.37 ; also sheet 32
MFD13: IC218.13(Y6) IC220.13(Y6) IC222.13(Y6) P8.38 ; also sheet 32
MFD14: IC218.12(Y7) IC220.12(Y7) IC222.12(Y7) P8.39 ; also sheet 32
MFD15: IC218.11(Y8) IC220.11(Y8) IC222.11(Y8) P8.40 ; also sheet 32
N$531: IC216.10(Y5) IC217.1(G1) IC217.19(G2) IC218.1(G1) IC218.19(G2)
N$532: IC216.7(Y7) IC219.1(G1) IC219.19(G2) IC220.1(G1) IC220.19(G2)
N$533: IC216.12(Y3) IC221.1(G1) IC221.19(G2) IC222.1(G1) IC222.19(G2)
N$542: IC223.9(B0) RN33.2 SW1.1
N$543: IC223.11(B1) RN33.3 SW1.2
N$544: IC223.14(B2) RN33.4 SW1.3
N$545: D4.A IC223.6(A=B_O)
N$546: D5.A IC223.5(A>B_O)
OR0: CON14.1 IC217.2(A1) RN29.2
OR1: CON14.2 IC217.3(A2) RN29.3
OR2: CON14.3 IC217.4(A3) RN29.4
OR3: CON14.4 IC217.5(A4) RN29.5
OR4: CON14.5 IC217.6(A5) RN29.6
OR5: CON14.6 IC217.7(A6) RN29.7
OR6: CON14.7 IC217.8(A7) RN29.8
OR7: CON14.8 IC217.9(A8) RN29.9
OR8: CON15.1 IC218.2(A1) RN30.2
OR9: CON15.2 IC218.3(A2) RN30.3
OR10: CON15.3 IC218.4(A3) RN30.4
OR11: CON15.4 IC218.5(A4) RN30.5
OR12: CON15.5 IC218.6(A5) RN30.6
OR13: CON15.6 IC218.7(A6) RN30.7
OR14: CON15.7 IC218.8(A7) RN30.8
OR15: CON15.8 IC218.9(A8) RN30.9
VCC [low power]: C306.2 C307.2 C308.2 C309.2 C310.2 C311.2 C312.2 C313.1 IC216.1(A) IC216.6(G1) IC223.3(A=B_I) RN29.1 RN30.1 RN31.1 RN32.1 RN33.1 RN34.1 RN35.1 ; also sheet 2,3,4,6,7,8,9,10,11,12,13,14,15,16,17,18,19,20,21,22,24,25,26,27,28,29,30,31,34,35,36,37,39,40,41,42,43,44,45,46,47,48,49
Unconnected: IC216.9(Y6) IC216.11(Y4) IC216.13(Y2) IC216.14(Y1) IC216.15(Y0) P8.1 P8.2 P8.3 P8.4 P8.5 P8.6 P8.7 P8.8 P8.9 P8.10 P8.11 P8.12 P8.13 P8.14 P8.15 P8.16 P8.17 P8.18 P8.19 P8.20 P8.21 P8.22 P8.23 P8.24 RN35.9

### Buses
MFD[0..15]

### Notes on the sheet
- 011 (uADDR)
- 101 (Output)
- 111 (DR)
- Output Register
- Microcode Address
- TODO:
- * DRC
- Diode logic is acceptable here because
- it is merely driving a front panel LED
- (via an 74HCxxx buffer).
- Set jumpers/switches for first uPC address of Execute cycle.
- Decoupling | For Microcode v1-v3, this is 3 (1 and 2)
- Fetch/Execute Decoder
- Data Register (DR)
- U

## Sheet 39 of 49
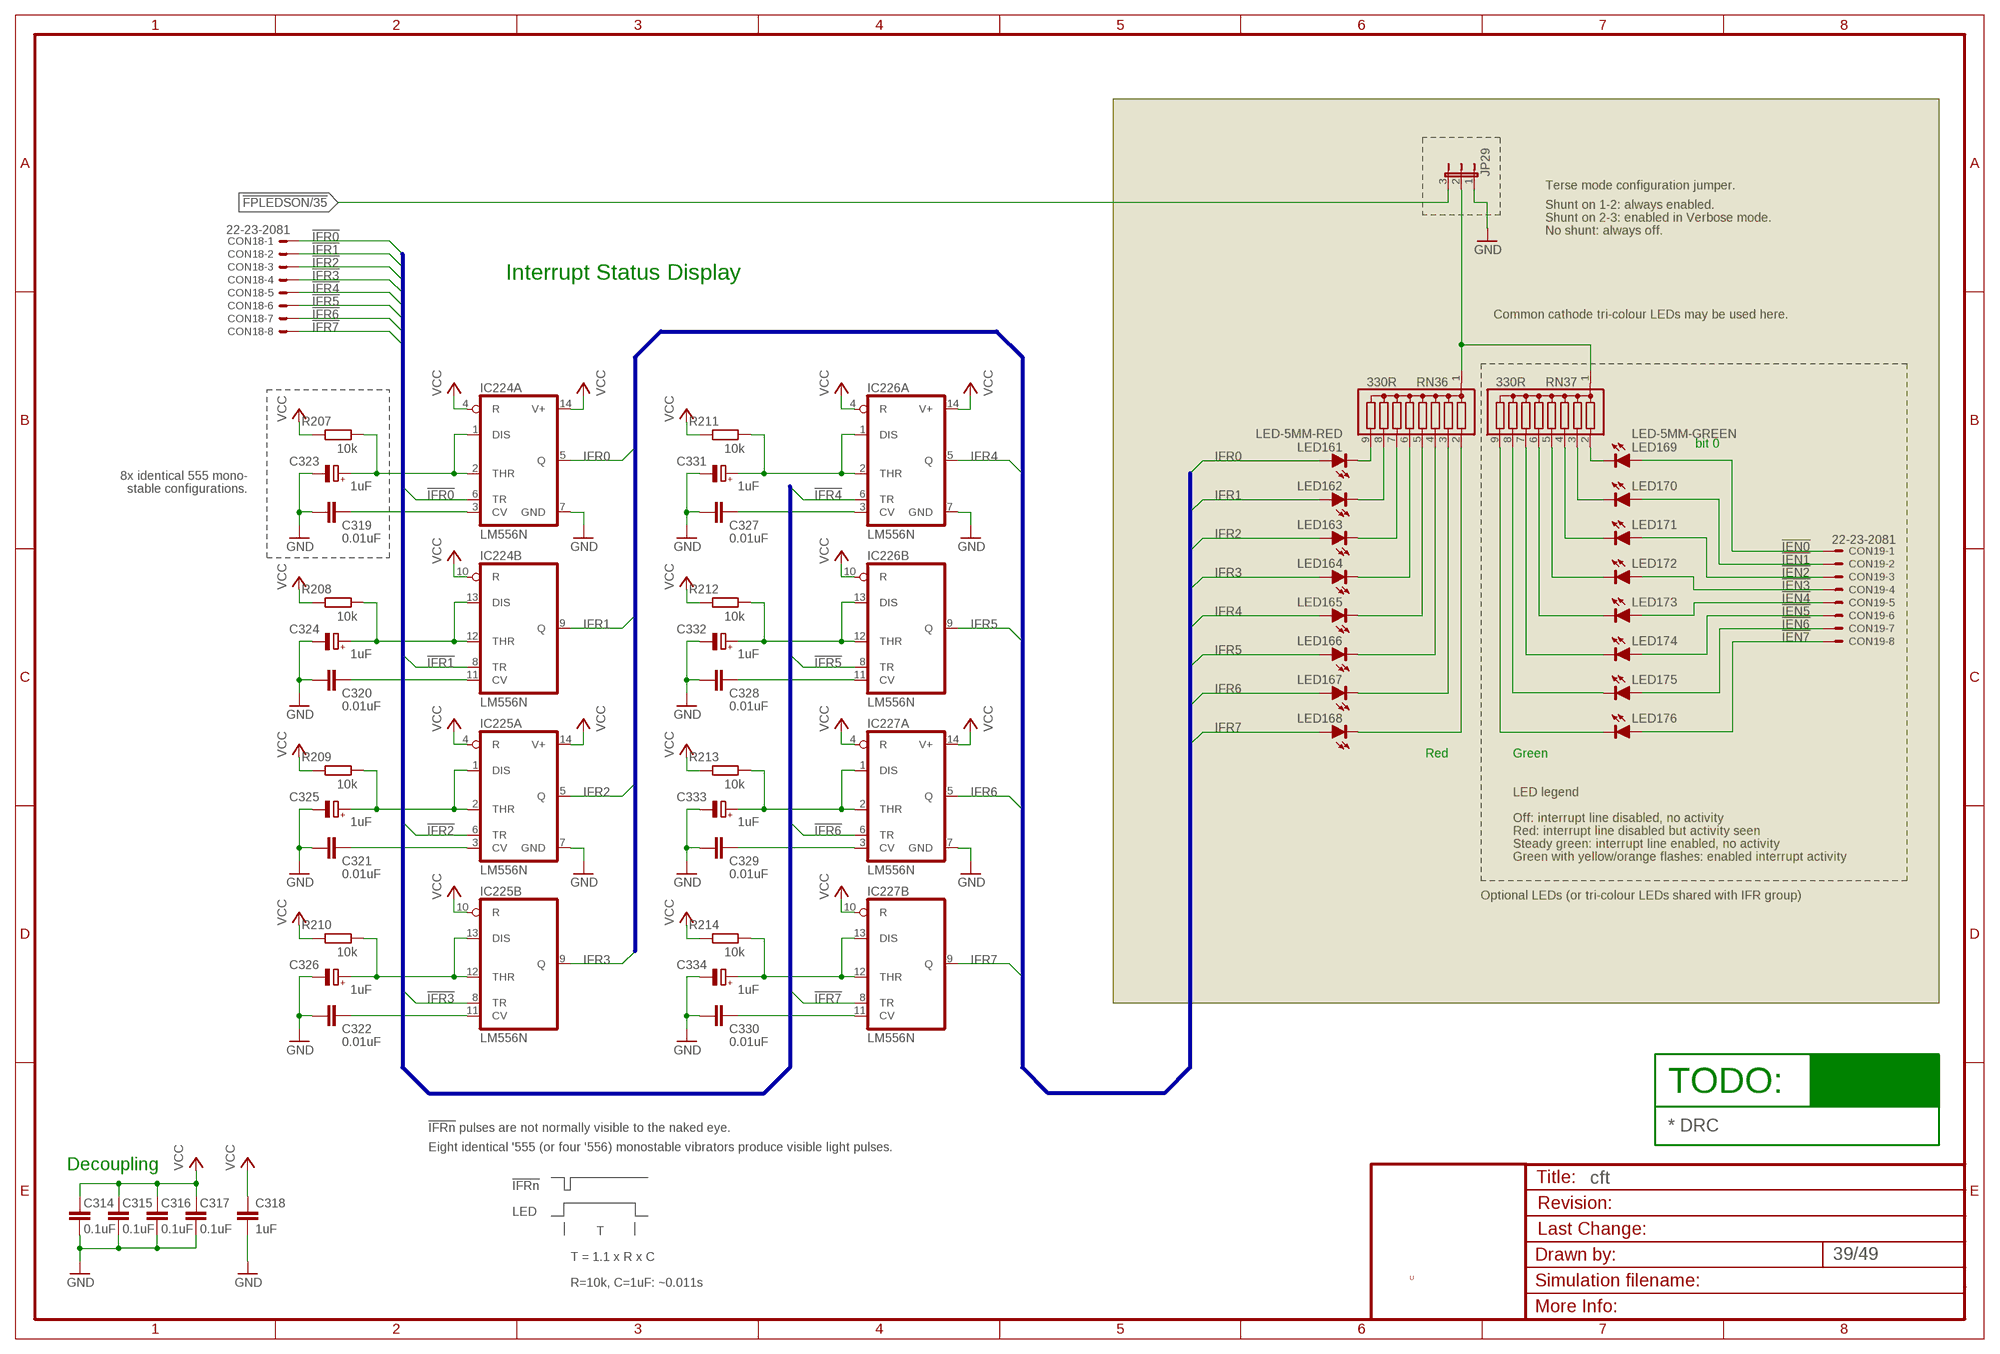
[diagram p38: schematic, sheet 39]

### Parts
C314  0.1uF  C-EU025-024X044  [C025-024X044]
C315  0.1uF  C-EU025-024X044  [C025-024X044]
C316  0.1uF  C-EU025-024X044  [C025-024X044]
C317  0.1uF  C-EU025-024X044  [C025-024X044]
C318  1uF  C-EU025-024X044  [C025-024X044]
C319  0.01uF  C-EU025-024X044  [C025-024X044]
C320  0.01uF  C-EU025-024X044  [C025-024X044]
C321  0.01uF  C-EU025-024X044  [C025-024X044]
C322  0.01uF  C-EU025-024X044  [C025-024X044]
C323  1uF  CPOL-EUE2.5-5  [E2,5-5]
C324  1uF  CPOL-EUE2.5-5  [E2,5-5]
C325  1uF  CPOL-EUE2.5-5  [E2,5-5]
C326  1uF  CPOL-EUE2.5-5  [E2,5-5]
C327  0.01uF  C-EU025-024X044  [C025-024X044]
C328  0.01uF  C-EU025-024X044  [C025-024X044]
C329  0.01uF  C-EU025-024X044  [C025-024X044]
C330  0.01uF  C-EU025-024X044  [C025-024X044]
C331  1uF  CPOL-EUE2.5-5  [E2,5-5]
C332  1uF  CPOL-EUE2.5-5  [E2,5-5]
C333  1uF  CPOL-EUE2.5-5  [E2,5-5]
C334  1uF  CPOL-EUE2.5-5  [E2,5-5]
CON18  22-23-2081  [22-23-2081]
CON19  22-23-2081  [22-23-2081]
IC224  LM556N  [DIL14]
IC225  LM556N  [DIL14]
IC226  LM556N  [DIL14]
IC227  LM556N  [DIL14]
JP29  JP2E  [JP2]
LED161  LED-5MM-RED  [LED5MM]
LED162  LED-5MM-RED  [LED5MM]
LED163  LED-5MM-RED  [LED5MM]
LED164  LED-5MM-RED  [LED5MM]
LED165  LED-5MM-RED  [LED5MM]
LED166  LED-5MM-RED  [LED5MM]
LED167  LED-5MM-RED  [LED5MM]
LED168  LED-5MM-RED  [LED5MM]
LED169  LED-5MM-GREEN  [LED5MM]
LED170  LED-5MM-GREEN  [LED5MM]
LED171  LED-5MM-GREEN  [LED5MM]
LED172  LED-5MM-GREEN  [LED5MM]
LED173  LED-5MM-GREEN  [LED5MM]
LED174  LED-5MM-GREEN  [LED5MM]
LED175  LED-5MM-GREEN  [LED5MM]
LED176  LED-5MM-GREEN  [LED5MM]
R207  10k  R-EU_0204/7  [0204/7]
R208  10k  R-EU_0204/7  [0204/7]
R209  10k  R-EU_0204/7  [0204/7]
R210  10k  R-EU_0204/7  [0204/7]
R211  10k  R-EU_0204/7  [0204/7]
R212  10k  R-EU_0204/7  [0204/7]
R213  10k  R-EU_0204/7  [0204/7]
R214  10k  R-EU_0204/7  [0204/7]
RN36  330R  G08R  [SIL9]
RN37  330R  G08R  [SIL9]

### Nets
!FPLEDSON: JP29.3 ; also sheet 35,37
!IEN0: CON19.1 LED169.A
!IEN1: CON19.2 LED170.A
!IEN2: CON19.3 LED171.A
!IEN3: CON19.4 LED172.A
!IEN4: CON19.5 LED173.A
!IEN5: CON19.6 LED174.A
!IEN6: CON19.7 LED175.A
!IEN7: CON19.8 LED176.A
!IFR0: CON18.1 IC224.6(A:TR)
!IFR1: CON18.2 IC224.8(B:TR) ; also sheet 34,40
!IFR2: CON18.3 IC225.6(A:TR)
!IFR3: CON18.4 IC225.8(B:TR)
!IFR4: CON18.5 IC226.6(A:TR)
!IFR5: CON18.6 IC226.8(B:TR)
!IFR6: CON18.7 IC227.6(A:TR) ; also sheet 34,40
!IFR7: CON18.8 IC227.8(B:TR)
GND [low power]: C314.1 C315.1 C316.1 C317.1 C318.2 C319.1 C320.1 C321.1 C322.1 C323.- C324.- C325.- C326.- C327.1 C328.1 C329.1 C330.1 C331.- C332.- C333.- C334.- IC224.7(A:GND) IC225.7(A:GND) IC226.7(A:GND) IC227.7(A:GND) JP29.1 ; also sheet 2,3,4,5,6,7,8,9,10,11,12,13,14,15,16,17,18,19,20,21,22,24,25,26,27,28,29,30,31,32,33,34,35,36,37,38,40,41,42,43,44,45,46,47,48,49
IFR0: IC224.5(A:Q) LED161.A ; also sheet 32
IFR1: IC224.9(B:Q) LED162.A ; also sheet 32
IFR2: IC225.5(A:Q) LED163.A ; also sheet 32
IFR3: IC225.9(B:Q) LED164.A ; also sheet 32
IFR4: IC226.5(A:Q) LED165.A ; also sheet 32
IFR5: IC226.9(B:Q) LED166.A ; also sheet 32
IFR6: IC227.5(A:Q) LED167.A ; also sheet 32
IFR7: IC227.9(B:Q) LED168.A ; also sheet 32
N$123: JP29.2 RN36.1 RN37.1
N$124: LED161.K(C) RN36.9
N$125: LED162.K(C) RN36.8
N$126: LED163.K(C) RN36.7
N$127: LED164.K(C) RN36.6
N$128: LED165.K(C) RN36.5
N$129: LED166.K(C) RN36.4
N$130: LED167.K(C) RN36.3
N$131: LED168.K(C) RN36.2
N$132: LED176.K(C) RN37.9
N$133: LED175.K(C) RN37.8
N$134: LED174.K(C) RN37.7
N$135: LED173.K(C) RN37.6
N$199: LED172.K(C) RN37.5
N$299: C325.+ IC225.1(A:DIS) IC225.2(A:THR) R209.1
N$370: LED171.K(C) RN37.4
N$371: LED170.K(C) RN37.3
N$372: LED169.K(C) RN37.2
N$395: C323.+ IC224.1(A:DIS) IC224.2(A:THR) R207.1
N$396: C319.2 IC224.3(A:CV)
N$397: C324.+ IC224.12(B:THR) IC224.13(B:DIS) R208.1
N$398: C320.2 IC224.11(B:CV)
N$399: C321.2 IC225.3(A:CV)
N$400: C326.+ IC225.12(B:THR) IC225.13(B:DIS) R210.1
N$401: C322.2 IC225.11(B:CV)
N$403: C331.+ IC226.1(A:DIS) IC226.2(A:THR) R211.1
N$404: C327.2 IC226.3(A:CV)
N$405: C332.+ IC226.12(B:THR) IC226.13(B:DIS) R212.1
N$406: C328.2 IC226.11(B:CV)
N$407: C333.+ IC227.1(A:DIS) IC227.2(A:THR) R213.1
N$408: C329.2 IC227.3(A:CV)
N$409: C334.+ IC227.12(B:THR) IC227.13(B:DIS) R214.1
N$410: C330.2 IC227.11(B:CV)
VCC [low power]: C314.2 C315.2 C316.2 C317.2 C318.1 IC224.4(A:R) IC224.10(B:R) IC224.14(A:V+) IC225.4(A:R) IC225.10(B:R) IC225.14(A:V+) IC226.4(A:R) IC226.10(B:R) IC226.14(A:V+) IC227.4(A:R) IC227.10(B:R) IC227.14(A:V+) R207.2 R208.2 R209.2 R210.2 R211.2 R212.2 R213.2 R214.2 ; also sheet 2,3,4,6,7,8,9,10,11,12,13,14,15,16,17,18,19,20,21,22,24,25,26,27,28,29,30,31,34,35,36,37,38,40,41,42,43,44,45,46,47,48,49

### Buses
!IFR[0..7]
IFR[0..7]

### Notes on the sheet
- Terse mode configuration jumper.
- Shunt on 1-2: always enabled.
- Shunt on 2-3: enabled in Verbose mode.
- No shunt: always off.
- Interrupt Status Display
- Common cathode tri-colour LEDs may be used here.
- bit 0
- 8x identical 555 mono-
- stable configurations.
- Red | Green
- LED legend
- Off: interrupt line disabled, no activity
- Red: interrupt line disabled but activity seen
- Steady green: interrupt line enabled, no activity
- Green with yellow/orange flashes: enabled interrupt activity
- Optional LEDs (or tri-colour LEDs shared with IFR group)
- TODO:
- !IFRn! pulses are not normally visible to the naked eye. | * DRC
- Eight identical '555 (or four '556) monostable vibrators produce visible light pulses.
- Decoupling
- !IFRn!
- LED
- T
- T = 1.1 x R x C
- U
- R=10k, C=1uF: ~0.011s

## Sheet 40 of 49
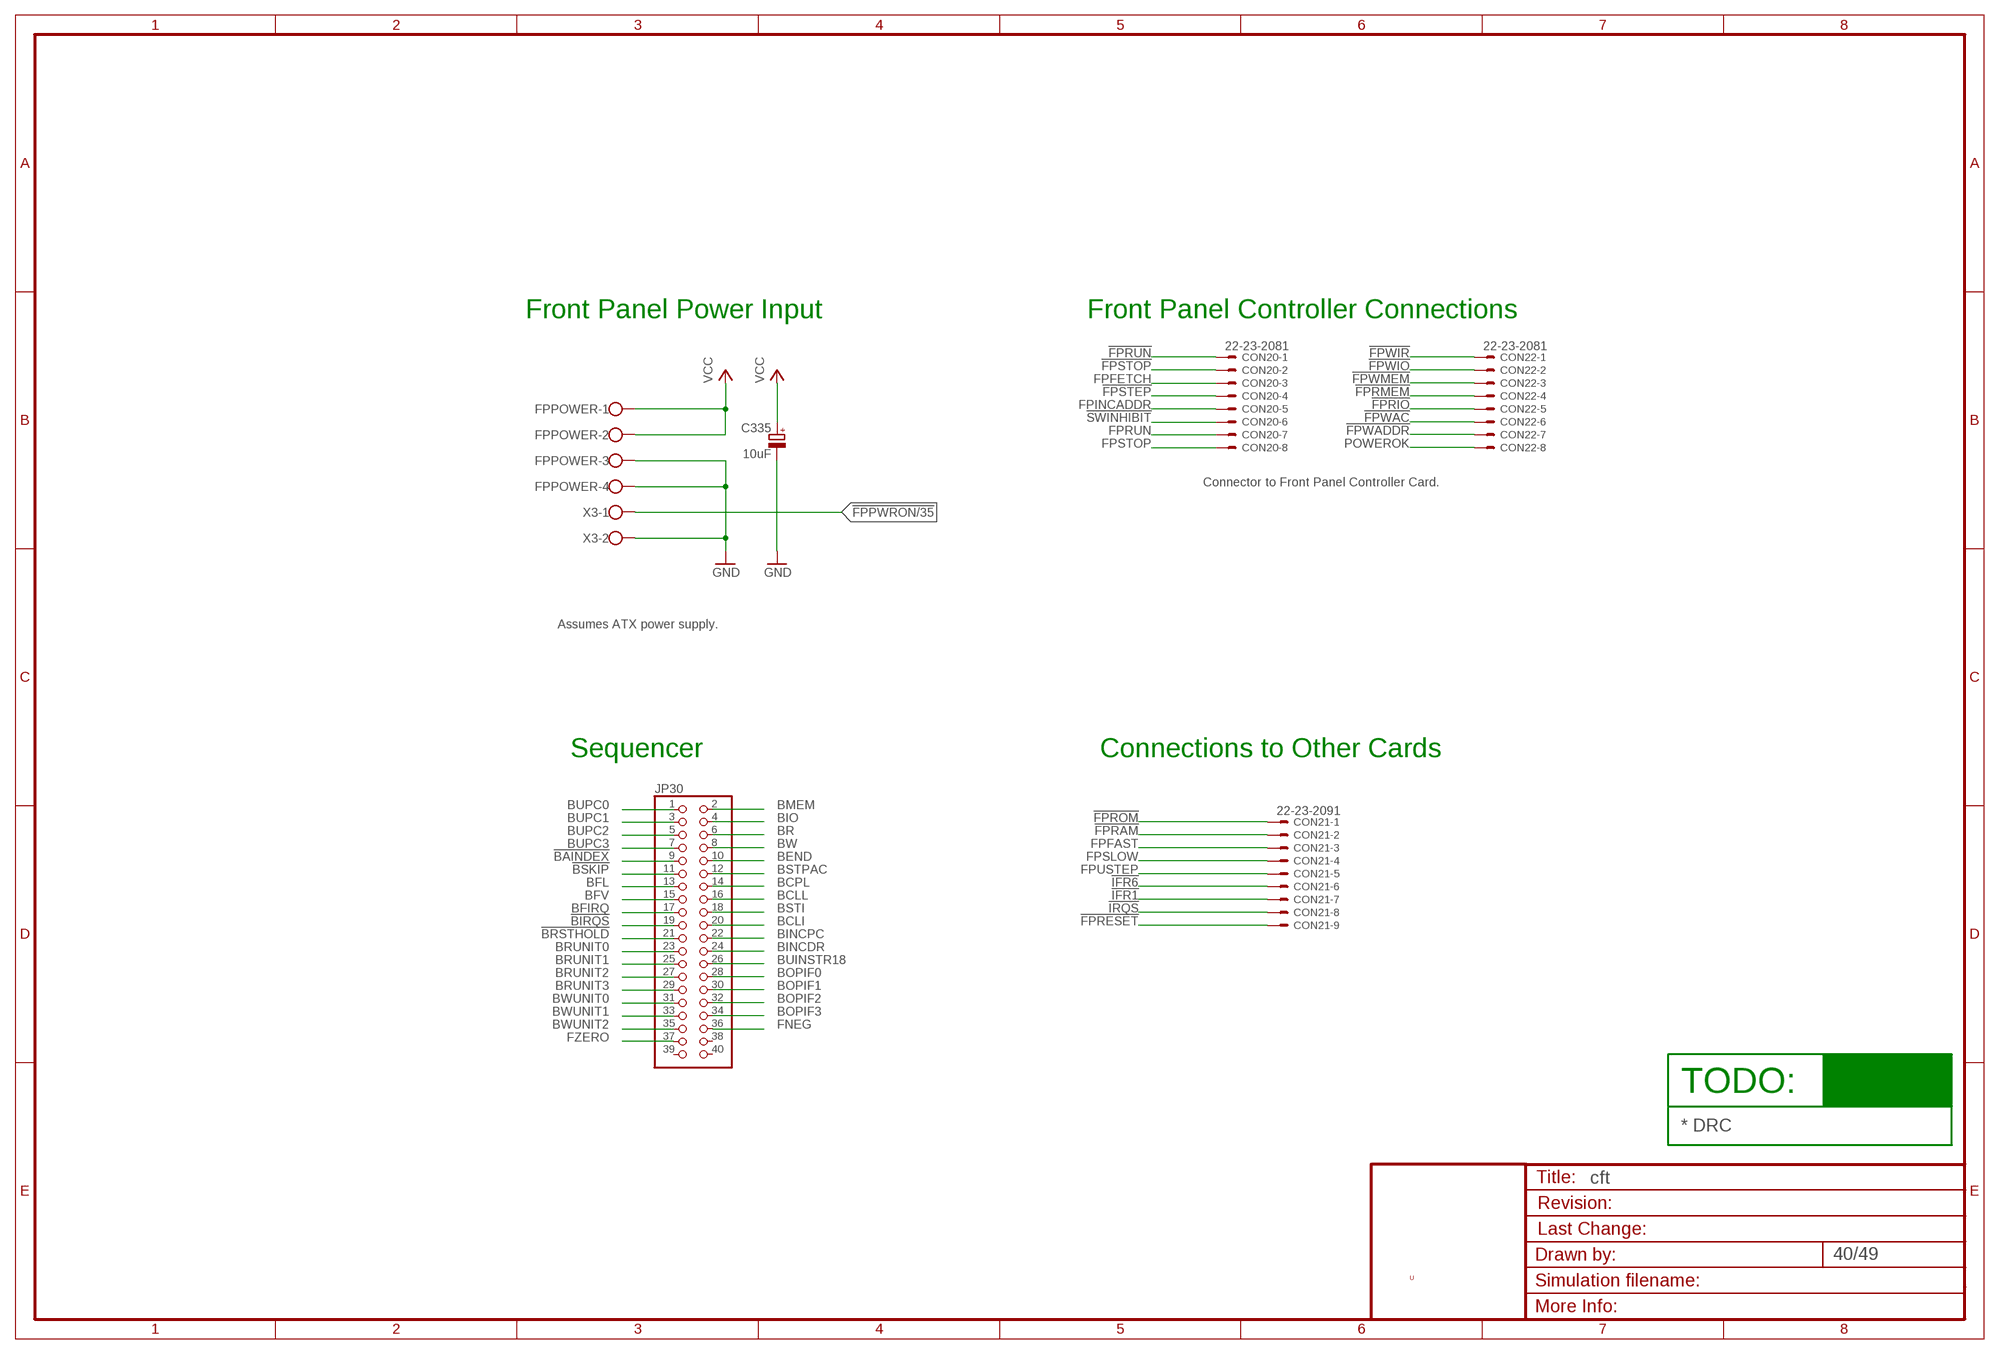
[diagram p39: schematic, sheet 40]

### Parts
C335  10uF  CPOL-EUE2.5-7  [E2,5-7]
CON20  22-23-2081  [22-23-2081]
CON21  22-23-2091  [22-23-2091]
CON22  22-23-2081  [22-23-2081]
FPPOWER  W237-4  [W237-4]
JP30  PINHD-2X20  [2X20]
X3  W237-102  [W237-102]

### Nets
!BAINDEX: JP30.9 ; also sheet 6,38
!BIRQS: JP30.19 ; also sheet 6,37,38
!BRSTHOLD: JP30.21 ; also sheet 6,38
!BSKIP: JP30.11 ; also sheet 6,38
!FPPWRON: X3.1 ; also sheet 35
!FPRAM: CON21.2 ; also sheet 21,35
!FPRESET: CON21.9 ; also sheet 3,6,34
!FPRIO: CON22.5 ; also sheet 34,42
!FPRMEM: CON22.4 ; also sheet 34,42
!FPROM: CON21.1 ; also sheet 35
!FPRUN: CON20.1 ; also sheet 34,42,43
!FPSTEP: CON20.4 ; also sheet 35,36,43
!FPSTOP: CON20.2 ; also sheet 34,43
!FPWAC: CON22.6 ; also sheet 34,41,42
!FPWADDR: CON22.7 ; also sheet 34,41,42
!FPWIO: CON22.2 ; also sheet 34,41,42
!FPWIR: CON22.1 ; also sheet 34,41,42
!FPWMEM: CON22.3 ; also sheet 34,41,42
!IFR1: CON21.7 ; also sheet 34,39
!IFR6: CON21.6 ; also sheet 34,39
!IRQS: CON21.8 ; also sheet 4,6,11,20,44,45,46
!SWINHIBIT: CON20.6 ; also sheet 34,43
BCLI: JP30.20 ; also sheet 6,32
BCLL: JP30.16 ; also sheet 6,32
BCPL: JP30.14 ; also sheet 6,32
BEND: JP30.10 ; also sheet 6,32
BFIRQ: JP30.17 ; also sheet 6,32
BFL: JP30.13 ; also sheet 6,32,38
BFV: JP30.15 ; also sheet 6,32,38
BINCDR: JP30.24 ; also sheet 6,32
BINCPC: JP30.22 ; also sheet 6,32
BIO: JP30.4 ; also sheet 6,32
BMEM: JP30.2 ; also sheet 6,32
BOPIF0: JP30.28 ; also sheet 6,32
BOPIF1: JP30.30 ; also sheet 6,32
BOPIF2: JP30.32 ; also sheet 6,32
BOPIF3: JP30.34 ; also sheet 6,32
BR: JP30.6 ; also sheet 6,32
BRUNIT0: JP30.23 ; also sheet 6,32
BRUNIT1: JP30.25 ; also sheet 6,32
BRUNIT2: JP30.27 ; also sheet 6,32
BRUNIT3: JP30.29 ; also sheet 6,32
BSTI: JP30.18 ; also sheet 6,32
BSTPAC: JP30.12 ; also sheet 6,32
BUINSTR18: JP30.26 ; also sheet 32
BUPC0: JP30.1 ; also sheet 6,38
BUPC1: JP30.3 ; also sheet 6,38
BUPC2: JP30.5 ; also sheet 6,38
BUPC3: JP30.7 ; also sheet 6,38
BW: JP30.8 ; also sheet 6,32
BWUNIT0: JP30.31 ; also sheet 6,32
BWUNIT1: JP30.33 ; also sheet 6,32
BWUNIT2: JP30.35 ; also sheet 6,32
FNEG: JP30.36 ; also sheet 5,6,8,16
FPFAST: CON21.3 ; also sheet 2,6,35
FPFETCH: CON20.3 ; also sheet 32,37,38,43
FPINCADDR: CON20.5 ; also sheet 34,42
FPRUN: CON20.7 ; also sheet 32,37,42,43
FPSLOW: CON21.4 ; also sheet 2,6,35
FPSTOP: CON20.8 ; also sheet 32,37,43
FPUSTEP: CON21.5 ; also sheet 2,6,35,45
FZERO: JP30.37 ; also sheet 5,6,8,16
GND [low power]: C335.- FPPOWER.3 FPPOWER.4 X3.2 ; also sheet 2,3,4,5,6,7,8,9,10,11,12,13,14,15,16,17,18,19,20,21,22,24,25,26,27,28,29,30,31,32,33,34,35,36,37,38,39,41,42,43,44,45,46,47,48,49
POWEROK: CON22.8 ; also sheet 3,6,43
VCC [low power]: C335.+ FPPOWER.1 FPPOWER.2 ; also sheet 2,3,4,6,7,8,9,10,11,12,13,14,15,16,17,18,19,20,21,22,24,25,26,27,28,29,30,31,34,35,36,37,38,39,41,42,43,44,45,46,47,48,49
Unconnected: JP30.38 JP30.39 JP30.40

### Notes on the sheet
- Front Panel Power Input | Front Panel Controller Connections
- Connector to Front Panel Controller Card.
- Assumes ATX power supply.
- Sequencer | Connections to Other Cards
- TODO:
- * DRC
- U

## Sheet 41 of 49
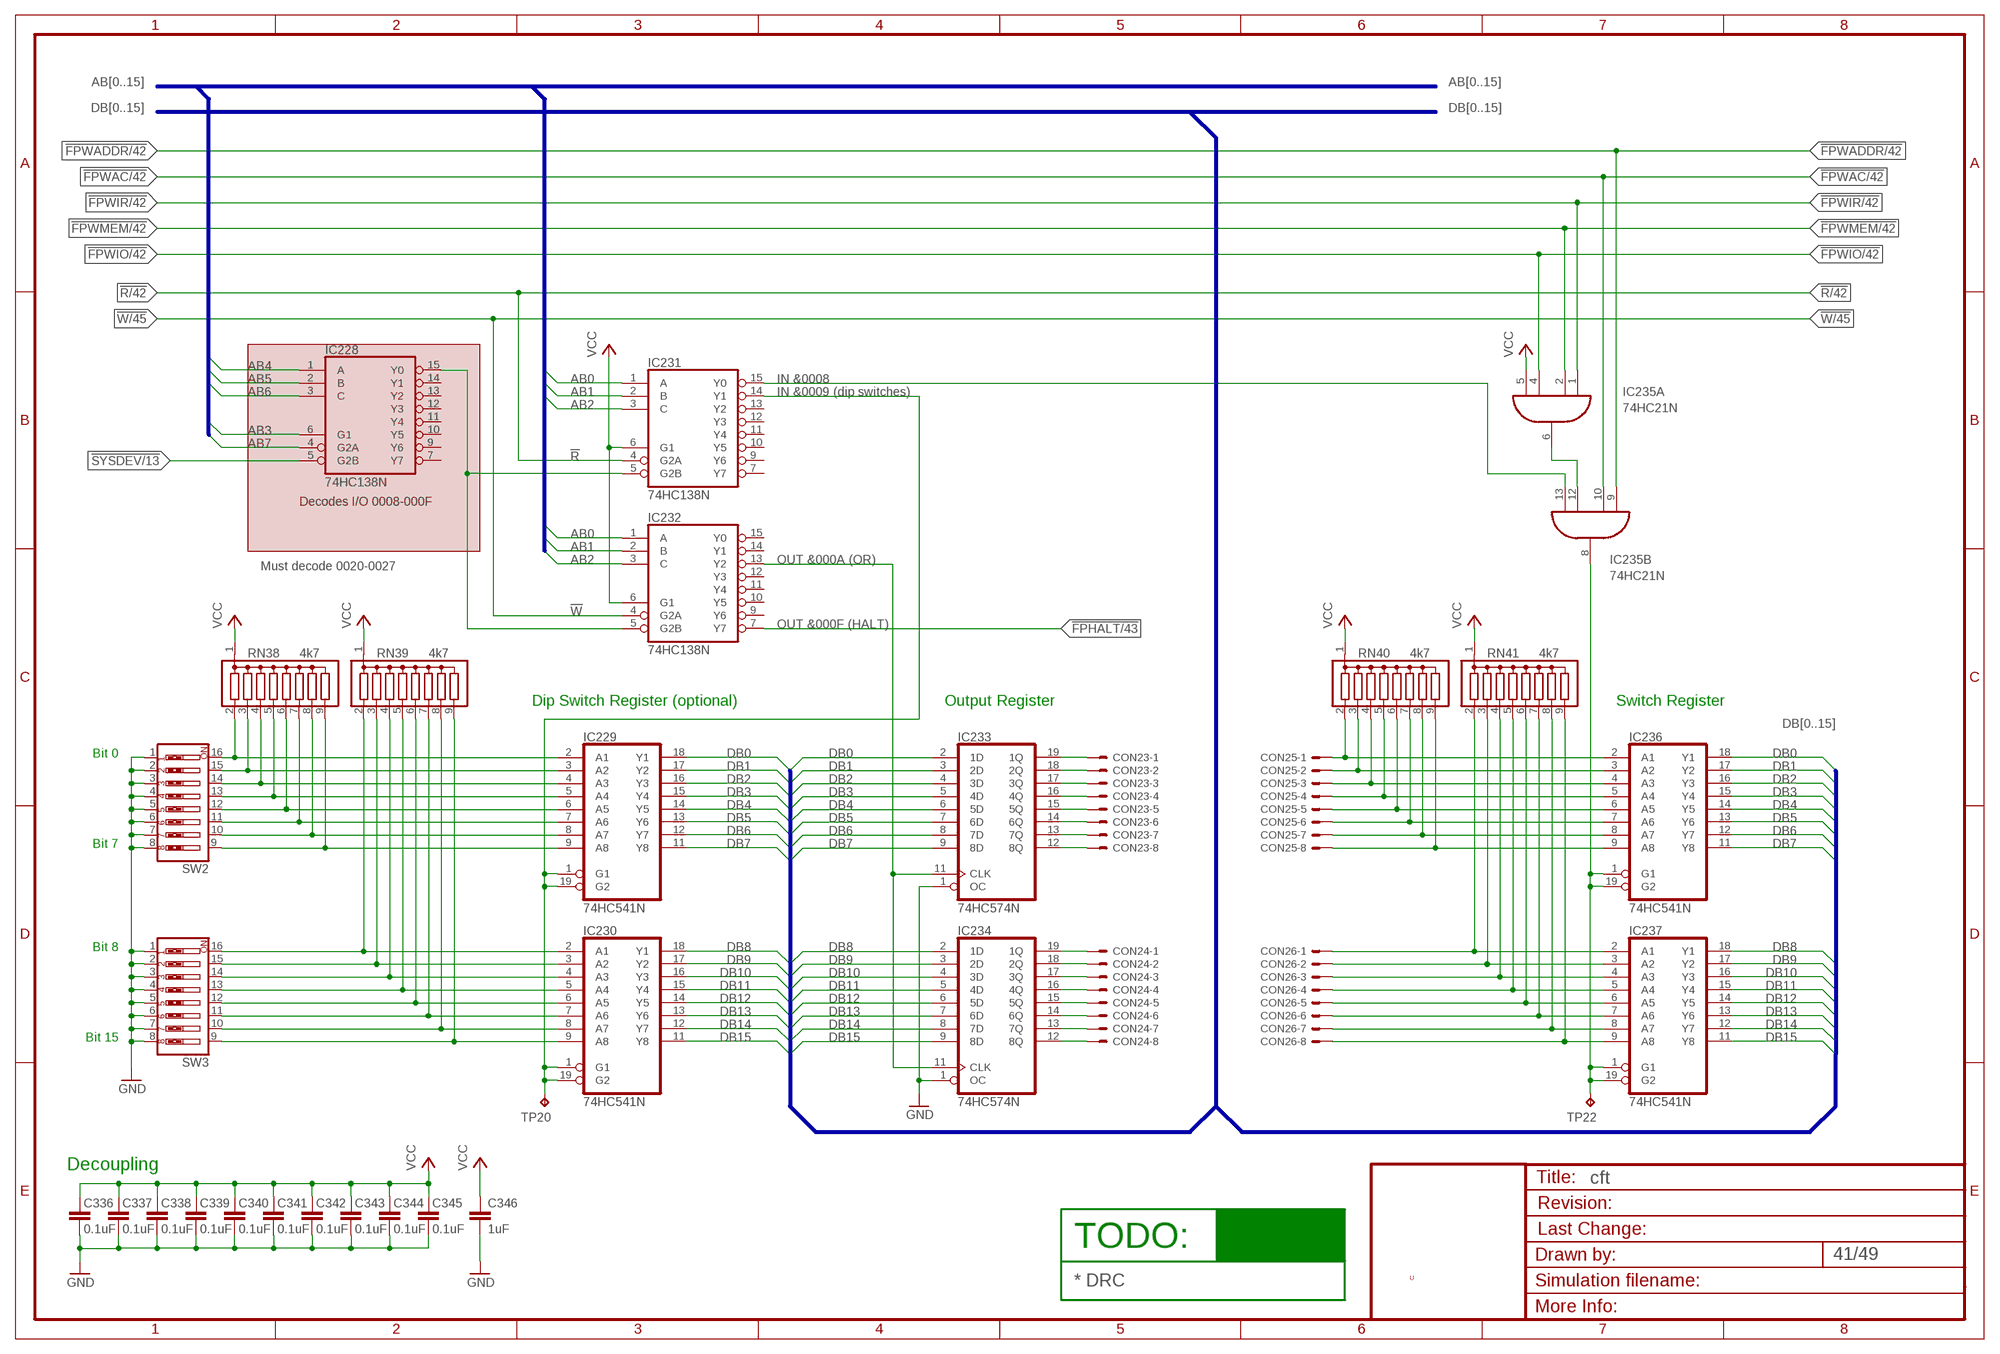
[diagram p40: schematic, sheet 41]

### Parts
C336  0.1uF  C-EU025-024X044  [C025-024X044]
C337  0.1uF  C-EU025-024X044  [C025-024X044]
C338  0.1uF  C-EU025-024X044  [C025-024X044]
C339  0.1uF  C-EU025-024X044  [C025-024X044]
C340  0.1uF  C-EU025-024X044  [C025-024X044]
C341  0.1uF  C-EU025-024X044  [C025-024X044]
C342  0.1uF  C-EU025-024X044  [C025-024X044]
C343  0.1uF  C-EU025-024X044  [C025-024X044]
C344  0.1uF  C-EU025-024X044  [C025-024X044]
C345  0.1uF  C-EU025-024X044  [C025-024X044]
C346  1uF  C-EU025-024X044  [C025-024X044]
CON23  22-23-2081  [22-23-2081]
CON24  22-23-2081  [22-23-2081]
CON25  22-23-2081  [22-23-2081]
CON26  22-23-2081  [22-23-2081]
IC228  74HC138N  [DIL16]
IC229  74HC541N  [DIL20]
IC230  74HC541N  [DIL20]
IC231  74HC138N  [DIL16]
IC232  74HC138N  [DIL16]
IC233  74HC574N  [DIL20]
IC234  74HC574N  [DIL20]
IC235  74HC21N  [DIL14]
IC236  74HC541N  [DIL20]
IC237  74HC541N  [DIL20]
RN38  4k7  G08R  [SIL9]
RN39  4k7  G08R  [SIL9]
RN40  4k7  G08R  [SIL9]
RN41  4k7  G08R  [SIL9]
SW2  SW_DIP-8  [EDG-08]
SW3  SW_DIP-8  [EDG-08]
TP20  TPPAD1-13  [P1-13]
TP22  TPPAD1-13  [P1-13]

### Nets
!CLKOREG1: IC232.13(Y2) IC233.11(CLK) IC234.11(CLK)
!FPHALT: IC232.7(Y7) ; also sheet 43
!FPWAC: IC235.10(B:I1) ; also sheet 34,40,42
!FPWADDR: IC235.9(B:I0) ; also sheet 34,40,42
!FPWIO: IC235.4(A:I2) ; also sheet 34,40,42
!FPWIR: IC235.1(A:I0) ; also sheet 34,40,42
!FPWMEM: IC235.2(A:I1) ; also sheet 34,40,42
!R: IC231.4(G2A) ; also sheet 4,5,6,12,22,24,25,26,27,28,29,30,42,44,45,46,47,48
!SYSDEV: IC228.5(G2B) ; also sheet 13,21,22,25,26,27,28,29,30,44,45,46
!W: IC232.4(G2A) ; also sheet 12,21,22,24,25,26,27,28,29,30,44,45,46,47,48
AB0: IC231.1(A) IC232.1(A) ; also sheet 13,21,24,25,26,27,28,29,30,44,45,46,47,48
AB1: IC231.2(B) IC232.2(B) ; also sheet 13,21,24,25,26,27,28,29,30,44,45,46,47,48
AB2: IC231.3(C) IC232.3(C) ; also sheet 13,21,24,25,26,27,29,30,44,45,46,47,48
AB3: IC228.6(G1) ; also sheet 13,24,25,26,27,28,29,30,44,45,46,47,48
AB4: IC228.1(A) ; also sheet 13,22,24,25,26,27,28,29,30,44,45,46,47,48
AB5: IC228.2(B) ; also sheet 13,21,22,24,25,26,27,28,29,30,44,45,46,47,48
AB6: IC228.3(C) ; also sheet 13,21,22,24,25,26,27,28,29,30,44,45,46,47,48
AB7: IC228.4(G2A) ; also sheet 13,21,22,24,25,26,27,28,29,30,44,45,46,47,48
DB0: IC229.18(Y1) IC233.2(1D) IC236.18(Y1) ; also sheet 12,21,22,24,25,26,27,28,29,30,31,44,45,46,47,48
DB1: IC229.17(Y2) IC233.3(2D) IC236.17(Y2) ; also sheet 12,21,22,24,25,26,27,28,29,30,31,44,45,46,47,48
DB2: IC229.16(Y3) IC233.4(3D) IC236.16(Y3) ; also sheet 12,21,22,24,25,26,27,28,29,30,31,44,45,46,47,48
DB3: IC229.15(Y4) IC233.5(4D) IC236.15(Y4) ; also sheet 12,21,22,24,25,26,27,28,29,30,31,44,45,46,47,48
DB4: IC229.14(Y5) IC233.6(5D) IC236.14(Y5) ; also sheet 12,21,22,24,25,26,27,28,29,30,31,44,45,46,47,48
DB5: IC229.13(Y6) IC233.7(6D) IC236.13(Y6) ; also sheet 12,21,22,24,25,26,27,28,29,30,31,44,45,46,47,48
DB6: IC229.12(Y7) IC233.8(7D) IC236.12(Y7) ; also sheet 12,21,22,24,25,26,27,28,29,30,31,44,45,46,47,48
DB7: IC229.11(Y8) IC233.9(8D) IC236.11(Y8) ; also sheet 12,21,22,24,25,26,27,28,29,30,31,44,45,46,47,48
DB8: IC230.18(Y1) IC234.2(1D) IC237.18(Y1) ; also sheet 12,21,24,26,27,29,30,31,44,45,46,48
DB9: IC230.17(Y2) IC234.3(2D) IC237.17(Y2) ; also sheet 12,24,26,27,29,30,44,45,46,48
DB10: IC230.16(Y3) IC234.4(3D) IC237.16(Y3) ; also sheet 12,24,26,27,29,30,44,45,46,48
DB11: IC230.15(Y4) IC234.5(4D) IC237.15(Y4) ; also sheet 12,24,26,27,29,30,44,45,46,48
DB12: IC230.14(Y5) IC234.6(5D) IC237.14(Y5) ; also sheet 12,24,26,27,29,30,44,45,46,48
DB13: IC230.13(Y6) IC234.7(6D) IC237.13(Y6) ; also sheet 12,24,26,27,29,30,44,45,46,48
DB14: IC230.12(Y7) IC234.8(7D) IC237.12(Y7) ; also sheet 12,24,26,27,29,30,44,45,46,48
DB15: IC230.11(Y8) IC234.9(8D) IC237.11(Y8) ; also sheet 12,24,26,27,29,30,44,45,46,48
GND [low power]: C336.1 C337.1 C338.1 C339.1 C340.1 C341.1 C342.1 C343.1 C344.1 C345.1 C346.2 IC233.1(OC) IC234.1(OC) SW2.1 SW2.2 SW2.3 SW2.4 SW2.5 SW2.6 SW2.7 SW2.8 SW3.1 SW3.2 SW3.3 SW3.4 SW3.5 SW3.6 SW3.7 SW3.8 ; also sheet 2,3,4,5,6,7,8,9,10,11,12,13,14,15,16,17,18,19,20,21,22,24,25,26,27,28,29,30,31,32,33,34,35,36,37,38,39,40,42,43,44,45,46,47,48,49
N$159: IC229.2(A1) RN38.2 SW2.16
N$160: IC229.3(A2) RN38.3 SW2.15
N$161: IC229.4(A3) RN38.4 SW2.14
N$162: IC229.5(A4) RN38.5 SW2.13
N$163: IC229.6(A5) RN38.6 SW2.12
N$164: IC229.7(A6) RN38.7 SW2.11
N$165: IC229.8(A7) RN38.8 SW2.10
N$166: IC229.9(A8) RN38.9 SW2.9
N$167: IC230.2(A1) RN39.2 SW3.16
N$168: IC230.3(A2) RN39.3 SW3.15
N$169: IC230.4(A3) RN39.4 SW3.14
N$170: IC230.5(A4) RN39.5 SW3.13
N$171: IC230.6(A5) RN39.6 SW3.12
N$172: IC230.7(A6) RN39.7 SW3.11
N$173: IC230.8(A7) RN39.8 SW3.10
N$174: IC230.9(A8) RN39.9 SW3.9
N$175: CON23.1 IC233.19(1Q)
N$176: CON23.2 IC233.18(2Q)
N$177: CON23.3 IC233.17(3Q)
N$178: CON23.4 IC233.16(4Q)
N$179: CON23.5 IC233.15(5Q)
N$180: CON23.6 IC233.14(6Q)
N$181: CON23.7 IC233.13(7Q)
N$182: CON23.8 IC233.12(8Q)
N$183: CON24.1 IC234.19(1Q)
N$184: CON24.2 IC234.18(2Q)
N$185: CON24.3 IC234.17(3Q)
N$186: CON24.4 IC234.16(4Q)
N$187: CON24.5 IC234.15(5Q)
N$188: CON24.6 IC234.14(6Q)
N$189: CON24.7 IC234.13(7Q)
N$193: CON24.8 IC234.12(8Q)
N$198: CON25.1 IC236.2(A1) RN40.2
N$201: CON25.2 IC236.3(A2) RN40.3
N$202: CON25.3 IC236.4(A3) RN40.4
N$205: CON25.4 IC236.5(A4) RN40.5
N$206: CON25.5 IC236.6(A5) RN40.6
N$207: CON25.6 IC236.7(A6) RN40.7
N$235: CON25.7 IC236.8(A7) RN40.8
N$245: CON25.8 IC236.9(A8) RN40.9
N$246: CON26.1 IC237.2(A1) RN41.2
N$247: CON26.2 IC237.3(A2) RN41.3
N$248: CON26.3 IC237.4(A3) RN41.4
N$249: CON26.4 IC237.5(A4) RN41.5
N$250: CON26.5 IC237.6(A5) RN41.6
N$273: CON26.6 IC237.7(A6) RN41.7
N$353: CON26.7 IC237.8(A7) RN41.8
N$354: CON26.8 IC237.9(A8) RN41.9
N$356: IC231.15(Y0) IC235.13(B:I3)
N$357: IC228.15(Y0) IC231.5(G2B) IC232.5(G2B)
N$358: IC235.6(A:O) IC235.12(B:I2)
N$359: IC229.1(G1) IC229.19(G2) IC230.1(G1) IC230.19(G2) IC231.14(Y1) TP20.TP
N$369: IC235.8(B:O) IC236.1(G1) IC236.19(G2) IC237.1(G1) IC237.19(G2) TP22.TP
VCC [low power]: C336.2 C337.2 C338.2 C339.2 C340.2 C341.2 C342.2 C343.2 C344.2 C345.2 C346.1 IC231.6(G1) IC232.6(G1) IC235.5(A:I3) RN38.1 RN39.1 RN40.1 RN41.1 ; also sheet 2,3,4,6,7,8,9,10,11,12,13,14,15,16,17,18,19,20,21,22,24,25,26,27,28,29,30,31,34,35,36,37,38,39,40,42,43,44,45,46,47,48,49
Unconnected: IC228.7(Y7) IC228.9(Y6) IC228.10(Y5) IC228.11(Y4) IC228.12(Y3) IC228.13(Y2) IC228.14(Y1) IC231.7(Y7) IC231.9(Y6) IC231.10(Y5) IC231.11(Y4) IC231.12(Y3) IC231.13(Y2) IC232.9(Y6) IC232.10(Y5) IC232.11(Y4) IC232.12(Y3) IC232.14(Y1) IC232.15(Y0)

### Buses
DB[0..15]
AB[0..15]

### Notes on the sheet
- IN &0008
- IN &0009 (dip switches)
- Decodes I/O 0008-000F
- OUT &000A (OR)
- Must decode 0020-0027
- OUT &000F (HALT)
- Dip Switch Register (optional) | Output Register | Switch Register
- Bit 0
- Bit 7
- Bit 8
- Bit 15
- Decoupling
- TODO:
- U
- * DRC

## Sheet 42 of 49
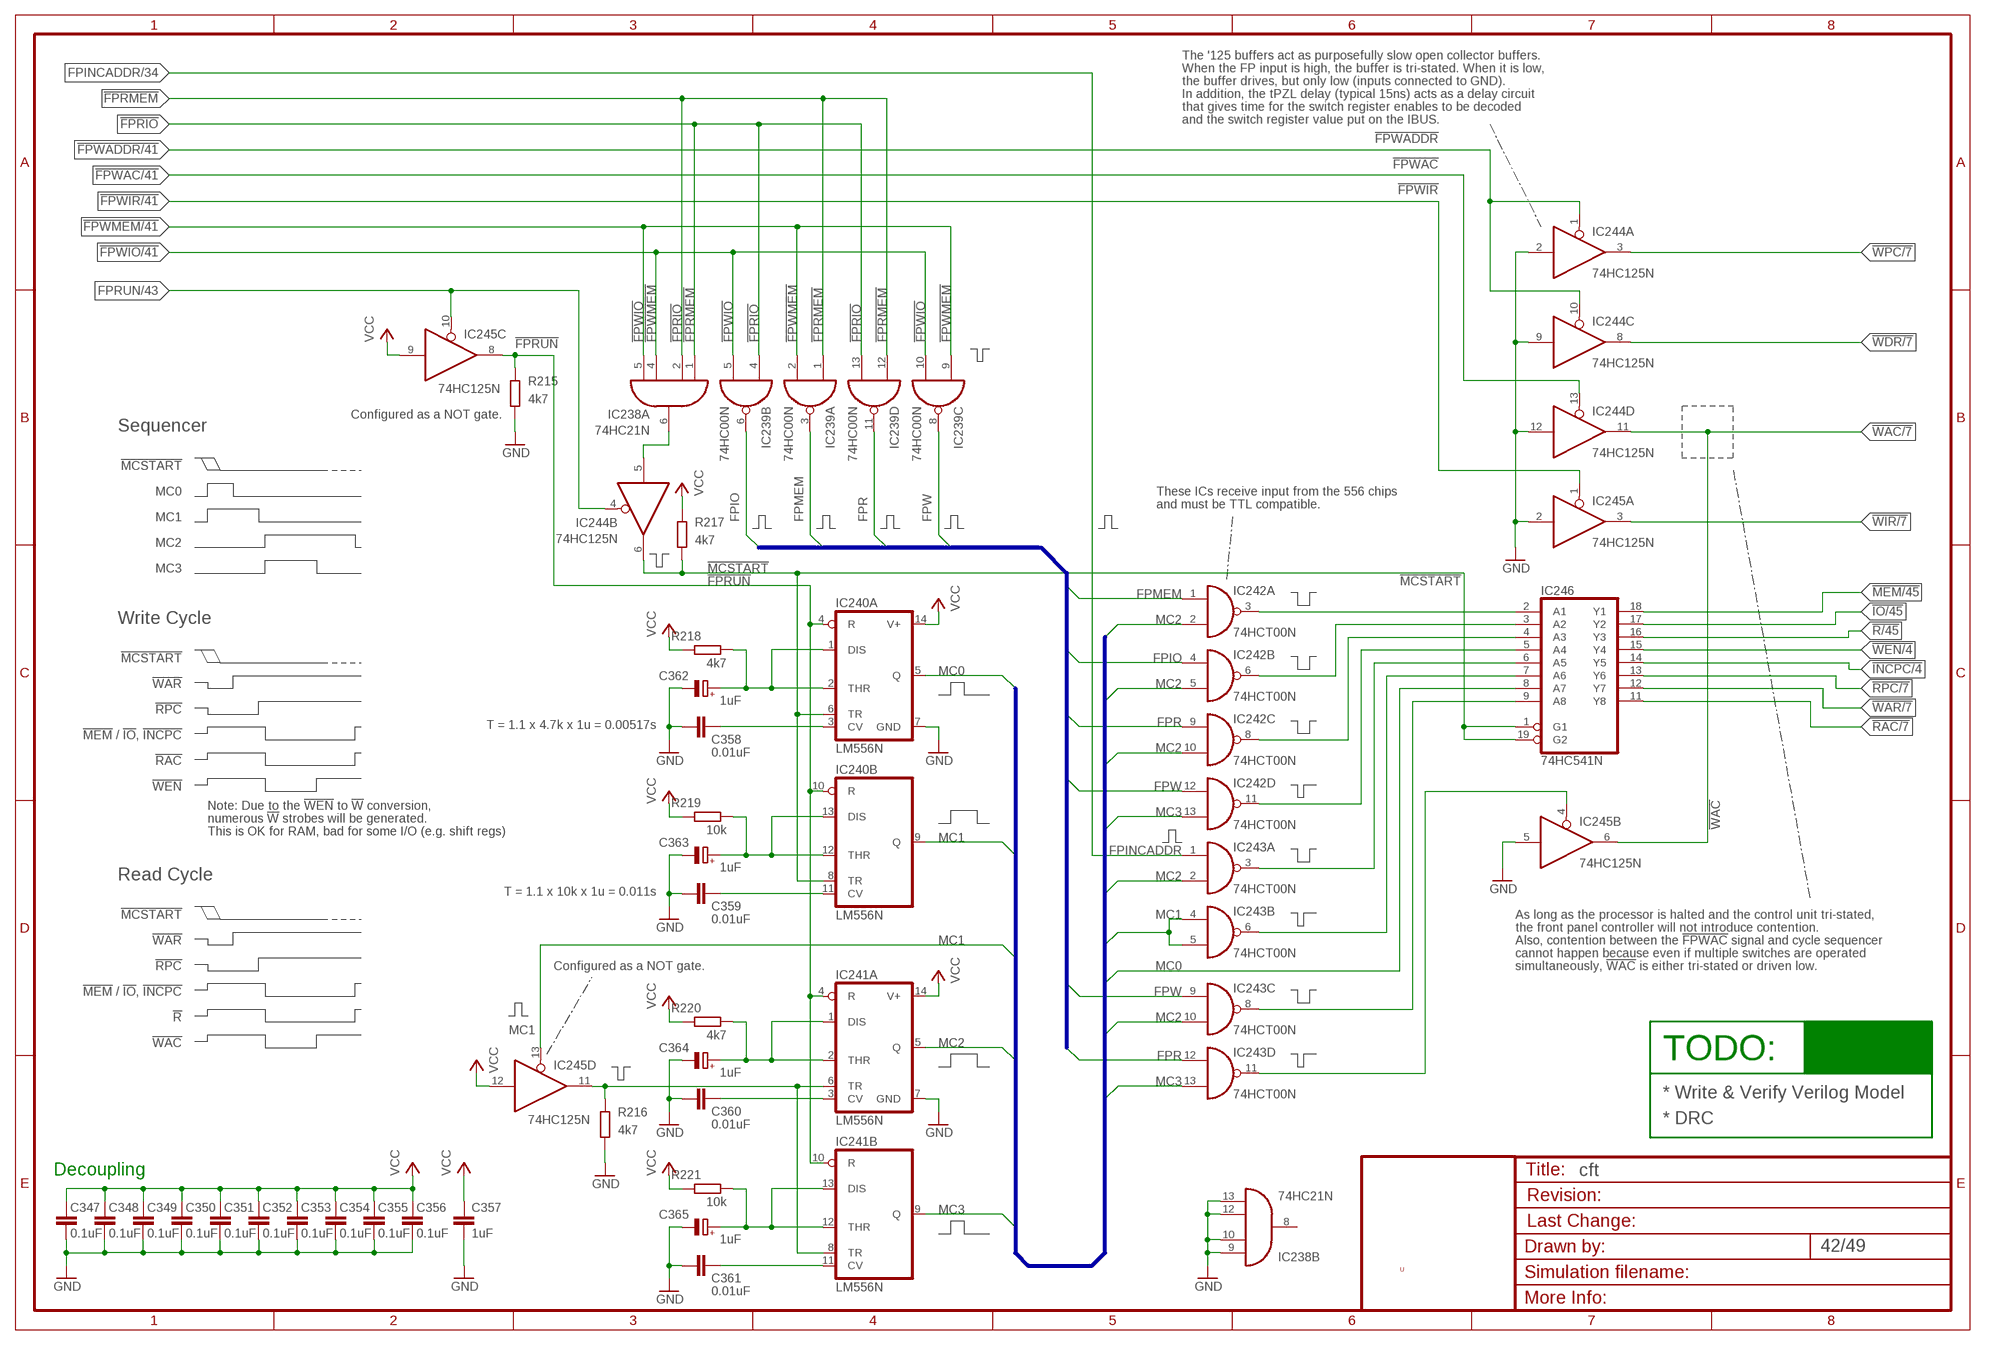
[diagram p41: schematic, sheet 42]

### Parts
C347  0.1uF  C-EU025-024X044  [C025-024X044]
C348  0.1uF  C-EU025-024X044  [C025-024X044]
C349  0.1uF  C-EU025-024X044  [C025-024X044]
C350  0.1uF  C-EU025-024X044  [C025-024X044]
C351  0.1uF  C-EU025-024X044  [C025-024X044]
C352  0.1uF  C-EU025-024X044  [C025-024X044]
C353  0.1uF  C-EU025-024X044  [C025-024X044]
C354  0.1uF  C-EU025-024X044  [C025-024X044]
C355  0.1uF  C-EU025-024X044  [C025-024X044]
C356  0.1uF  C-EU025-024X044  [C025-024X044]
C357  1uF  C-EU025-024X044  [C025-024X044]
C358  0.01uF  C-EU025-024X044  [C025-024X044]
C359  0.01uF  C-EU025-024X044  [C025-024X044]
C360  0.01uF  C-EU025-024X044  [C025-024X044]
C361  0.01uF  C-EU025-024X044  [C025-024X044]
C362  1uF  CPOL-EUE2.5-5  [E2,5-5]
C363  1uF  CPOL-EUE2.5-5  [E2,5-5]
C364  1uF  CPOL-EUE2.5-5  [E2,5-5]
C365  1uF  CPOL-EUE2.5-5  [E2,5-5]
IC238  74HC21N  [DIL14]
IC239  74HC00N  [DIL14]
IC240  LM556N  [DIL14]
IC241  LM556N  [DIL14]
IC242  74HCT00N  [DIL14]
IC243  74HCT00N  [DIL14]
IC244  74HC125N  [DIL14]
IC245  74HC125N  [DIL14]
IC246  74HC541N  [DIL20]
R215  4k7  R-EU_0204/7  [0204/7]
R216  4k7  R-EU_0204/7  [0204/7]
R217  4k7  R-EU_0204/7  [0204/7]
R218  4k7  R-EU_0204/7  [0204/7]
R219  10k  R-EU_0204/7  [0204/7]
R220  4k7  R-EU_0204/7  [0204/7]
R221  10k  R-EU_0204/7  [0204/7]

### Nets
!FPRIO: IC238.1(A:I0) IC239.4(B:I0) IC239.13(D:I1) ; also sheet 34,40
!FPRMEM: IC238.2(A:I1) IC239.1(A:I0) IC239.12(D:I0) ; also sheet 34,40
!FPRUN: IC240.4(A:R) IC240.10(B:R) IC241.4(A:R) IC241.10(B:R) IC245.8(C:O) R215.2 ; also sheet 34,40,43
!FPWAC: IC244.13(D:OE) ; also sheet 34,40,41
!FPWADDR: IC244.1(A:OE) IC244.10(C:OE) ; also sheet 34,40,41
!FPWIO: IC238.4(A:I2) IC239.5(B:I1) IC239.10(C:I1) ; also sheet 34,40,41
!FPWIR: IC245.1(A:OE) ; also sheet 34,40,41
!FPWMEM: IC238.5(A:I3) IC239.2(A:I1) IC239.9(C:I0) ; also sheet 34,40,41
!INCPC: IC246.14(Y5) ; also sheet 4,5,6,14
!IO: IC246.17(Y2) ; also sheet 4,5,6,12,13,44,45,46
!MCSTART: IC240.6(A:TR) IC240.8(B:TR) IC244.6(B:O) IC246.1(G1) IC246.19(G2) R217.1
!MEM: IC246.18(Y1) ; also sheet 4,5,6,12,13,21,24,44,45,46
!R: IC246.16(Y3) ; also sheet 4,5,6,12,22,24,25,26,27,28,29,30,41,44,45,46,47,48
!RAC: IC246.11(Y8) ; also sheet 6,7,16
!RPC: IC246.13(Y6) ; also sheet 6,7,14
!WAC: IC244.11(D:O) IC245.6(B:O) ; also sheet 6,7,16
!WAR: IC246.12(Y7) ; also sheet 6,7,13
!WDR: IC244.8(C:O) ; also sheet 6,7,15
!WEN: IC246.15(Y4) ; also sheet 4,5,6,12
!WIR: IC245.3(A:O) ; also sheet 6,7,10
!WPC: IC244.3(A:O) ; also sheet 6,7,14
FPINCADDR: IC243.1(A:I0) ; also sheet 34,40
FPIO: IC239.6(B:O) IC242.4(B:I0)
FPMEM: IC239.3(A:O) IC242.1(A:I0)
FPR: IC239.11(D:O) IC242.9(C:I0) IC243.12(D:I0)
FPRUN: IC244.4(B:OE) IC245.10(C:OE) ; also sheet 32,37,40,43
FPW: IC239.8(C:O) IC242.12(D:I0) IC243.9(C:I0)
GND [low power]: C347.1 C348.1 C349.1 C350.1 C351.1 C352.1 C353.1 C354.1 C355.1 C356.1 C357.2 C358.1 C359.1 C360.1 C361.1 C362.- C363.- C364.- C365.- IC238.9(B:I0) IC238.10(B:I1) IC238.12(B:I2) IC238.13(B:I3) IC240.7(A:GND) IC241.7(A:GND) IC244.2(A:I) IC244.9(C:I) IC244.12(D:I) IC245.2(A:I) IC245.5(B:I) R215.1 R216.1 ; also sheet 2,3,4,5,6,7,8,9,10,11,12,13,14,15,16,17,18,19,20,21,22,24,25,26,27,28,29,30,31,32,33,34,35,36,37,38,39,40,41,43,44,45,46,47,48,49
MC0: IC240.5(A:Q) IC246.8(A7)
MC1: IC240.9(B:Q) IC243.4(B:I0) IC243.5(B:I1) IC245.13(D:OE)
MC2: IC241.5(A:Q) IC242.2(A:I1) IC242.5(B:I1) IC242.10(C:I1) IC243.2(A:I1) IC243.10(C:I1)
MC3: IC241.9(B:Q) IC242.13(D:I1) IC243.13(D:I1)
N$38: C363.+ IC240.12(B:THR) IC240.13(B:DIS) R219.1
N$40: C362.+ IC240.1(A:DIS) IC240.2(A:THR) R218.1
N$41: IC241.6(A:TR) IC241.8(B:TR) IC245.11(D:O) R216.2
N$42: C358.2 IC240.3(A:CV)
N$43: C359.2 IC240.11(B:CV)
N$44: C364.+ IC241.1(A:DIS) IC241.2(A:THR) R220.1
N$45: C360.2 IC241.3(A:CV)
N$389: C365.+ IC241.12(B:THR) IC241.13(B:DIS) R221.1
N$390: C361.2 IC241.11(B:CV)
N$394: IC238.6(A:O) IC244.5(B:I)
N$650: IC242.3(A:O) IC246.2(A1)
N$651: IC242.6(B:O) IC246.3(A2)
N$652: IC242.8(C:O) IC246.4(A3)
N$653: IC242.11(D:O) IC246.5(A4)
N$654: IC243.3(A:O) IC246.6(A5)
N$655: IC243.6(B:O) IC246.7(A6)
N$656: IC243.8(C:O) IC246.9(A8)
N$657: IC243.11(D:O) IC245.4(B:OE)
VCC [low power]: C347.2 C348.2 C349.2 C350.2 C351.2 C352.2 C353.2 C354.2 C355.2 C356.2 C357.1 IC240.14(A:V+) IC241.14(A:V+) IC245.9(C:I) IC245.12(D:I) R217.2 R218.2 R219.2 R220.2 R221.2 ; also sheet 2,3,4,6,7,8,9,10,11,12,13,14,15,16,17,18,19,20,21,22,24,25,26,27,28,29,30,31,34,35,36,37,38,39,40,41,43,44,45,46,47,48,49
Unconnected: IC238.8(B:O)

### Buses
FPMEM,FPIO,FPR,FPW
!MC[0..3]

### Notes on the sheet
- The '125 buffers act as purposefully slow open collector buffers.
- When the FP input is high, the buffer is tri-stated. When it is low,
- the buffer drives, but only low (inputs connected to GND).
- In addition, the tPZL delay (typical 15ns) acts as a delay circuit
- that gives time for the switch register enables to be decoded
- and the switch register value put on the IBUS.
- Configured as a NOT gate.
- Sequencer
- These ICs receive input from the 556 chips
- and must be TTL compatible.
- Write Cycle
- !WAR
- !RPC
- T = 1.1 x 4.7k x 1u = 0.00517s
- !MEM! / !IO!, !INCPC!
- !RAC
- !WEN
- Note: Due to the !WEN! to !W! conversion,
- numerous !W! strobes will be generated.
- This is OK for RAM, bad for some I/O (e.g. shift regs)
- Read Cycle
- T = 1.1 x 10k x 1u = 0.011s
- As long as the processor is halted and the control unit tri-stated,
- the front panel controller will not introduce contention.
- !WAR | Also, contention between the !FPWAC! signal and cycle sequencer
- cannot happen because even if multiple switches are operated
- !RPC | Configured as a NOT gate. | simultaneously, !WAC! is either tri-stated or driven low.
- !MEM! / !IO!, !INCPC!
- !R
- !WAC
- TODO:
- * Write & Verify Verilog Model
- * DRC
- Decoupling
- U

## Sheet 43 of 49
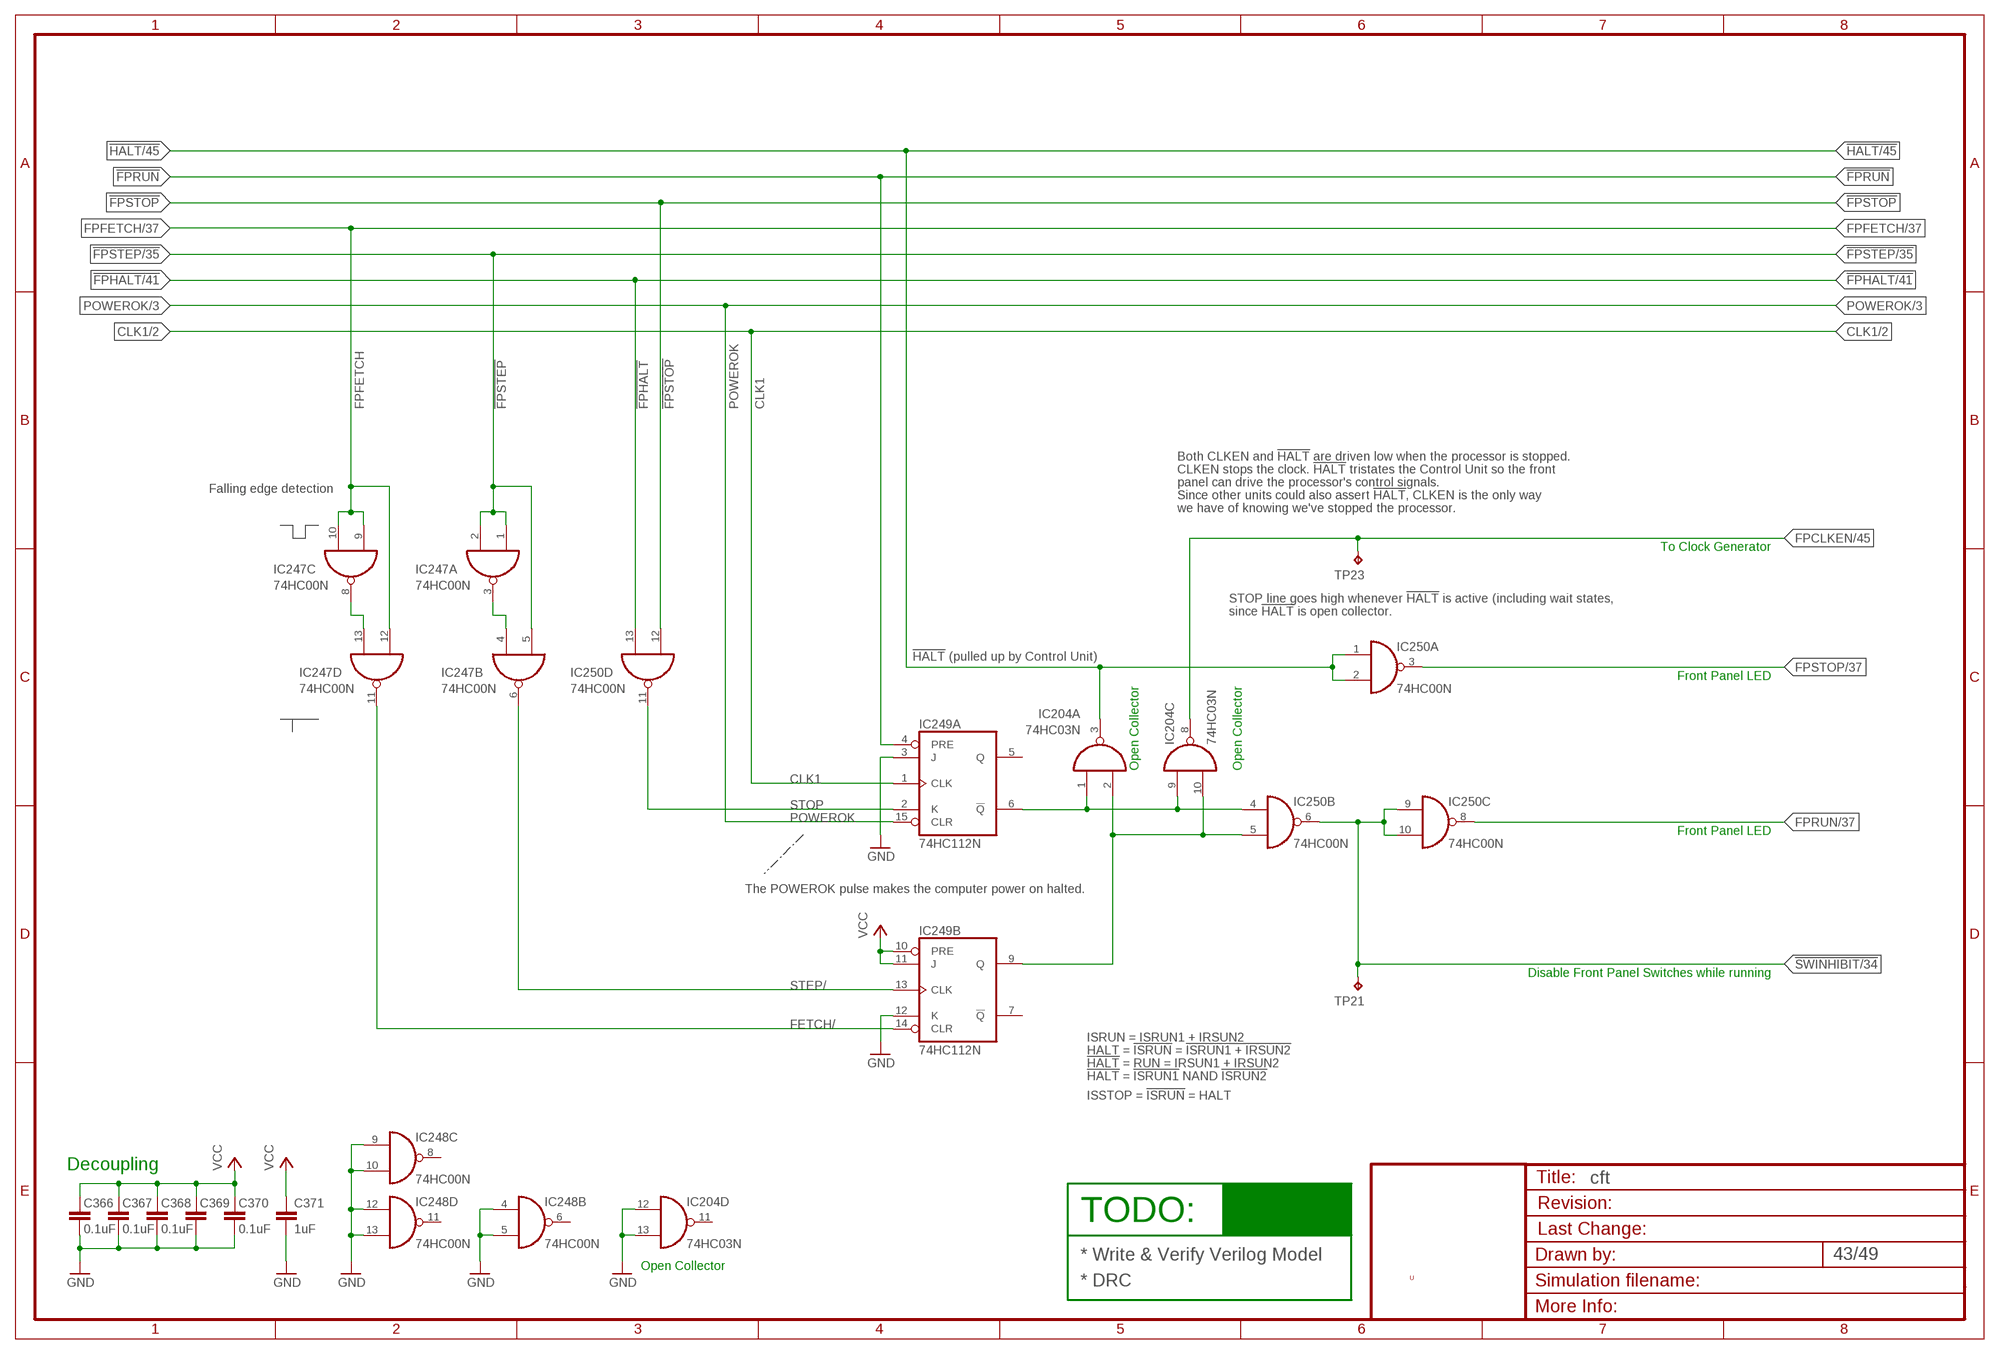
[diagram p42: schematic, sheet 43]

### Parts
C366  0.1uF  C-EU025-024X044  [C025-024X044]
C367  0.1uF  C-EU025-024X044  [C025-024X044]
C368  0.1uF  C-EU025-024X044  [C025-024X044]
C369  0.1uF  C-EU025-024X044  [C025-024X044]
C370  0.1uF  C-EU025-024X044  [C025-024X044]
C371  1uF  C-EU025-024X044  [C025-024X044]
IC247  74HC00N  [DIL14]
IC248  74HC00N  [DIL14]
IC249  74HC112N  [DIL16]
IC250  74HC00N  [DIL14]
TP21  TPPAD1-13  [P1-13]
TP23  TPPAD1-13  [P1-13]

### Nets
!FPHALT: IC250.13(D:I1) ; also sheet 41
!FPRUN: IC249.4(A:PRE) ; also sheet 34,40,42
!FPSTEP: IC247.1(A:I0) IC247.2(A:I1) IC247.5(B:I1) ; also sheet 35,36,40
!FPSTOP: IC250.12(D:I0) ; also sheet 34,40
!HALT: IC204.3(A:O) IC250.1(A:I0) IC250.2(A:I1) ; also sheet 4,44,45,46
!SWINHIBIT: IC250.6(B:O) IC250.9(C:I0) IC250.10(C:I1) TP21.TP ; also sheet 34,40
CLK1: IC249.1(A:CLK) ; also sheet 2,7,27,31,44,45,46
FETCH/: IC247.11(D:O) IC249.14(B:CLR)
FPCLKEN: IC204.8(C:O) TP23.TP ; also sheet 2,6,35,45
FPFETCH: IC247.9(C:I0) IC247.10(C:I1) IC247.12(D:I0) ; also sheet 32,37,38,40
FPRUN: IC250.8(C:O) ; also sheet 32,37,40,42
FPSTOP: IC250.3(A:O) ; also sheet 32,37,40
GND [low power]: C366.1 C367.1 C368.1 C369.1 C370.1 C371.2 IC204.12(D:I0) IC204.13(D:I1) IC248.4(B:I0) IC248.5(B:I1) IC248.9(C:I0) IC248.10(C:I1) IC248.12(D:I0) IC248.13(D:I1) IC249.3(A:J) IC249.12(B:K) ; also sheet 2,3,4,5,6,7,8,9,10,11,12,13,14,15,16,17,18,19,20,21,22,24,25,26,27,28,29,30,31,32,33,34,35,36,37,38,39,40,41,42,44,45,46,47,48,49
N$155: IC247.3(A:O) IC247.4(B:I0)
N$157: IC247.8(C:O) IC247.13(D:I1)
N$158: IC204.1(A:I0) IC204.9(C:I0) IC249.6(A:!Q) IC250.4(B:I0)
N$360: IC204.2(A:I1) IC204.10(C:I1) IC249.9(B:Q) IC250.5(B:I1)
POWEROK: IC249.15(A:CLR) ; also sheet 3,6,40
STEP/: IC247.6(B:O) IC249.13(B:CLK)
STOP: IC249.2(A:K) IC250.11(D:O)
VCC [low power]: C366.2 C367.2 C368.2 C369.2 C370.2 C371.1 IC249.10(B:PRE) IC249.11(B:J) ; also sheet 2,3,4,6,7,8,9,10,11,12,13,14,15,16,17,18,19,20,21,22,24,25,26,27,28,29,30,31,34,35,36,37,38,39,40,41,42,44,45,46,47,48,49
Unconnected: IC204.11(D:O) IC248.1(A:I0) IC248.2(A:I1) IC248.3(A:O) IC248.6(B:O) IC248.8(C:O) IC248.11(D:O) IC249.5(A:Q) IC249.7(B:!Q)

### Notes on the sheet
- Both CLKEN and !HALT! are driven low when the processor is stopped.
- CLKEN stops the clock. !HALT! tristates the Control Unit so the front
- panel can drive the processor's control signals.
- Falling edge detection
- Since other units could also assert !HALT!, CLKEN is the only way
- we have of knowing we've stopped the processor.
- To Clock Generator
- STOP line goes high whenever !HALT! is active (including wait states,
- since !HALT! is open collector.
- !HALT! (pulled up by Control Unit)
- Front Panel LED
- Open Collector | Open Collector
- Front Panel LED
- The POWEROK pulse makes the computer power on halted.
- Disable Front Panel Switches while running
- ISRUN = ISRUN1 + IRSUN2
- HALT = !ISRUN! = !ISRUN1 + IRSUN2!
- !HALT! = RUN = IRSUN1 + IRSUN2
- !HALT! = !ISRUN1! NAND !ISRUN2!
- ISSTOP = !ISRUN! = HALT
- Decoupling
- TODO:
- Open Collector | * Write & Verify Verilog Model
- U
- * DRC